# EAGLE design mk312_smt_main_V2a (EAGLE 9.6.2)

## Sheet 1 of 4: PSU
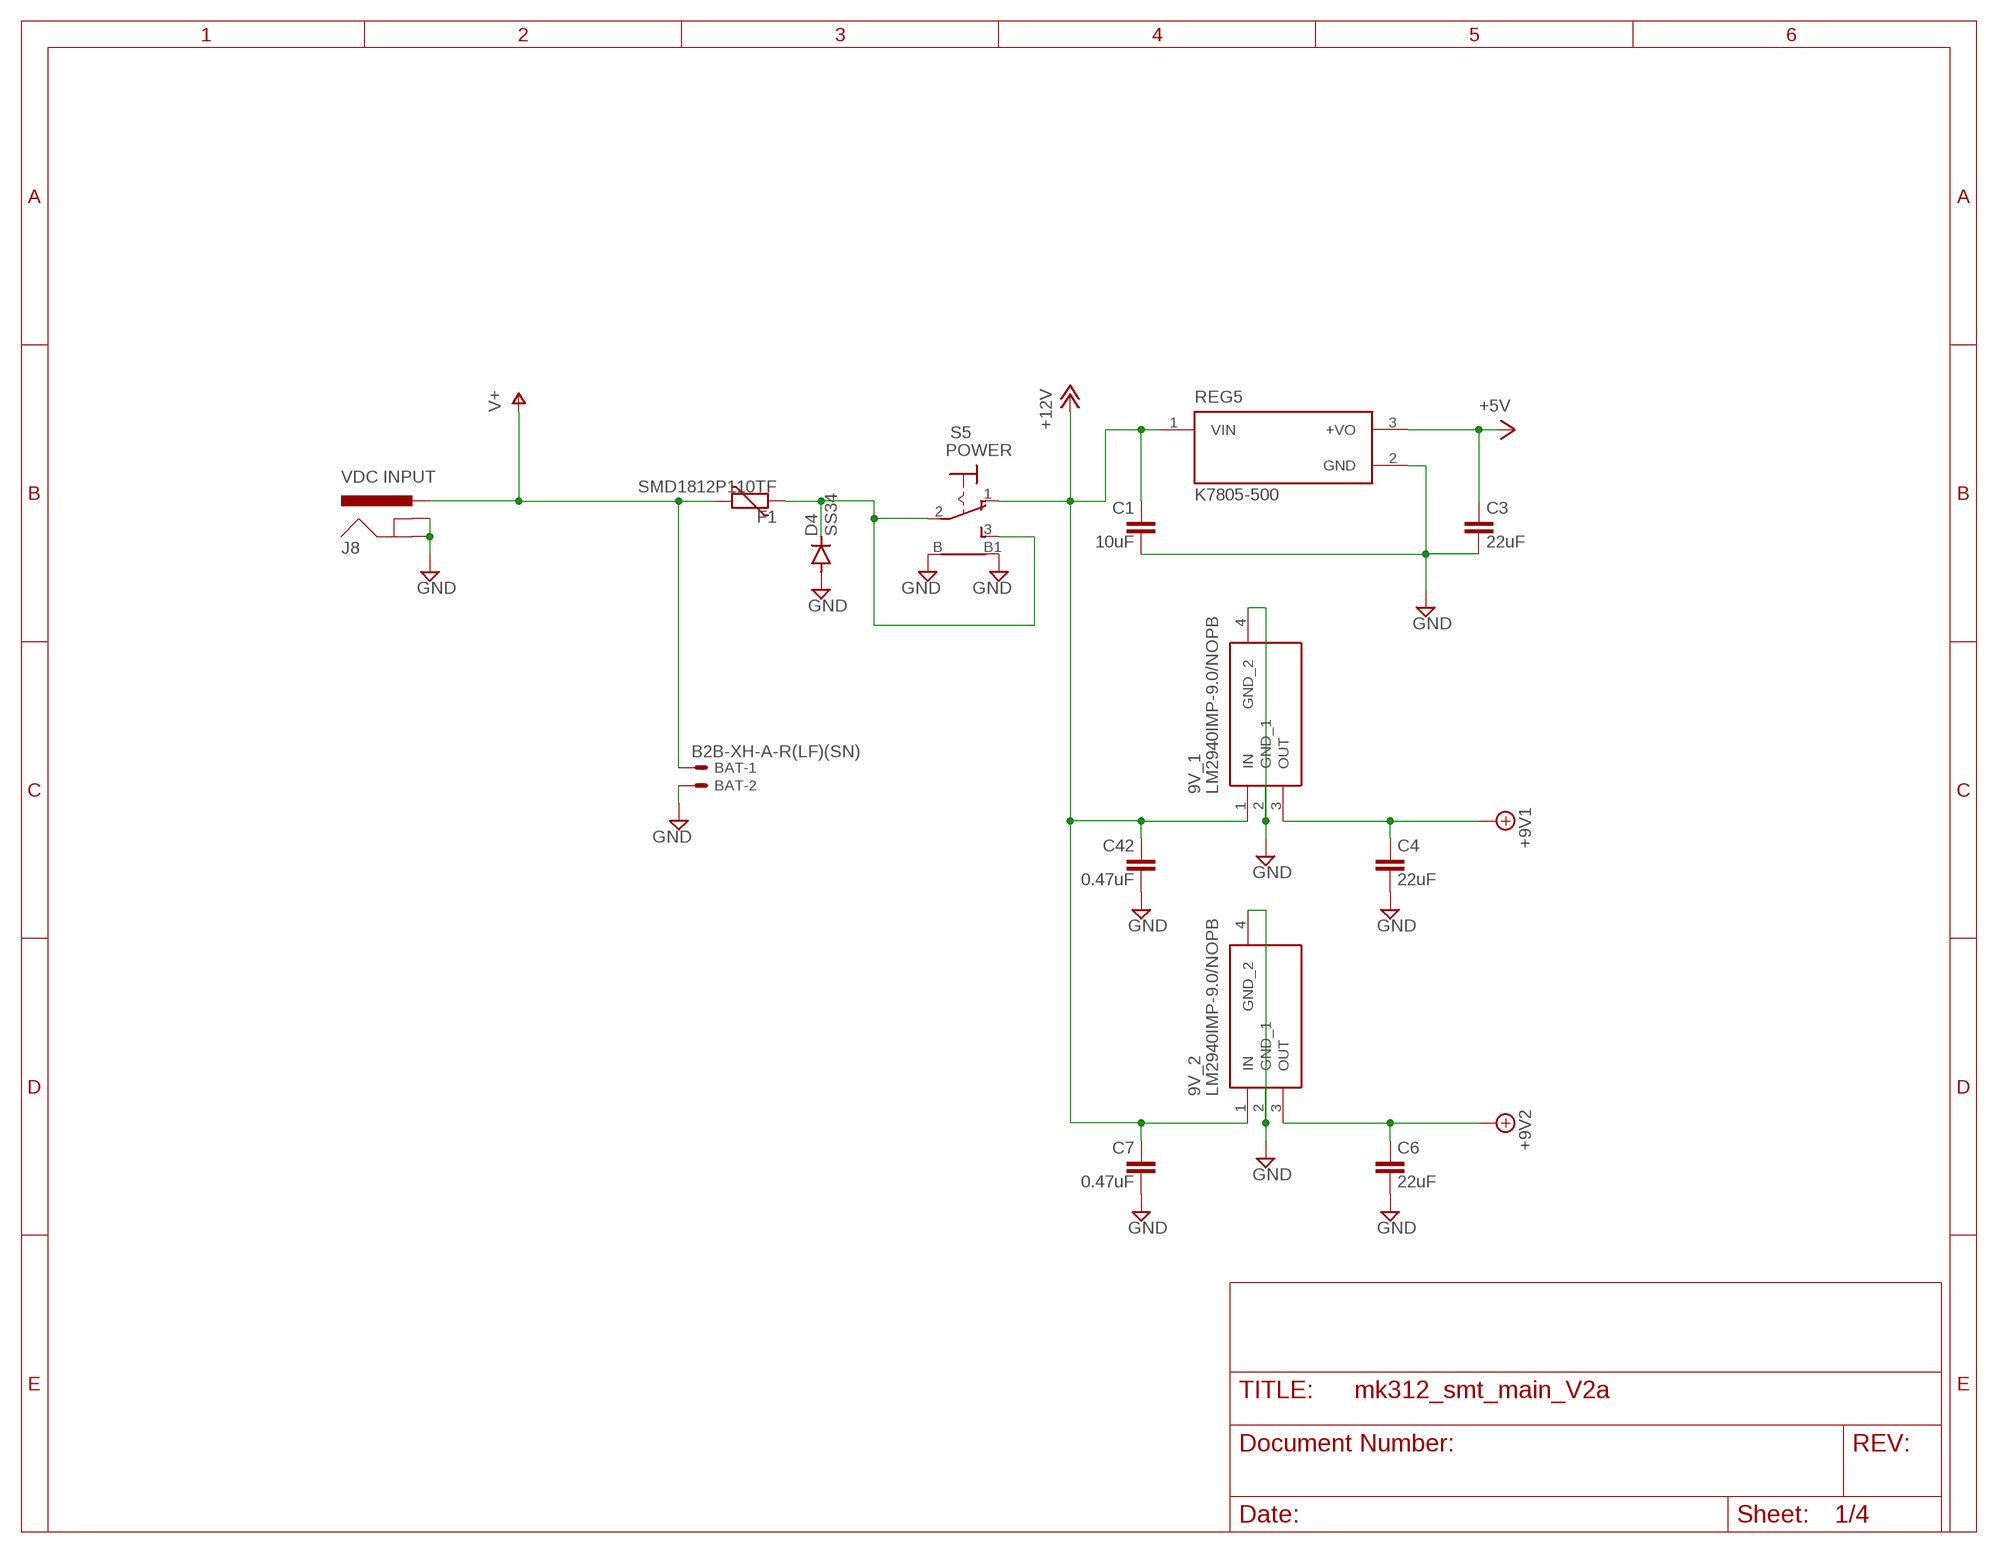
[diagram p0: schematic, sheet 1]

### Parts
9V_1  LM2940IMP-9.0/NOPB  LM2940IMP-9.0_NOPB  [SOT230P700X180-4N]
9V_2  LM2940IMP-9.0/NOPB  LM2940IMP-9.0_NOPB  [SOT230P700X180-4N]
BAT  B2B-XH-A-R(LF)(SN)  JST-XH-02-PIN-LONG-PAD  [JST-XH-02-PACKAGE-LONG-PAD]
C1  10uF  C-EUC0805  [C0805]
C3  22uF  C-EUC1206  [C1206]
C4  22uF  C-EUC1206  [C1206]
C6  22uF  C-EUC1206  [C1206]
C7  0.47uF  C-EUC0805  [C0805]
C42  0.47uF  C-EUC0805  [C0805]
D4  SS34  S1M  [SMA]
F1  SMD1812P110TF  VARISTORCN1812  [CT/CN1812]
J8  VDC INPUT  POWER_JACKPOWER_JACK_SLOT  [POWER_JACK_PTH_SLOT]
REG5  K7805-500  K7809M-1000R3  [CONV_K7809M-1000R3]
S5  POWER  LPV-1  [LPV-1]

### Nets
+5V [pwr]: C3.1 REG5.3(+VO) ; also sheet 2,3,4
+9V1 [pwr]: 9V_1.3(OUT) C4.1 ; also sheet 4
+9V2 [pwr]: 9V_2.3(OUT) C6.1 ; also sheet 4
+12V [pwr]: 9V_1.1(IN) 9V_2.1(IN) C1.1 C7.1 C42.1 REG5.1(VIN) S5.1(O) ; also sheet 2
GND [pwr]: 9V_1.2(GND_1) 9V_1.4(GND_2) 9V_2.2(GND_1) 9V_2.4(GND_2) BAT.2 C1.2 C3.2 C4.2 C6.2 C7.2 C42.2 D4.A J8.GND J8.GNDBREAK REG5.2(GND) S5.B S5.B1 ; also sheet 2,3,4
N$9 [pwr]: D4.C F1.2 S5.2(P) S5.3(S)
V+ [pwr]: BAT.1 F1.1 J8.PWR ; also sheet 2

## Sheet 2 of 4
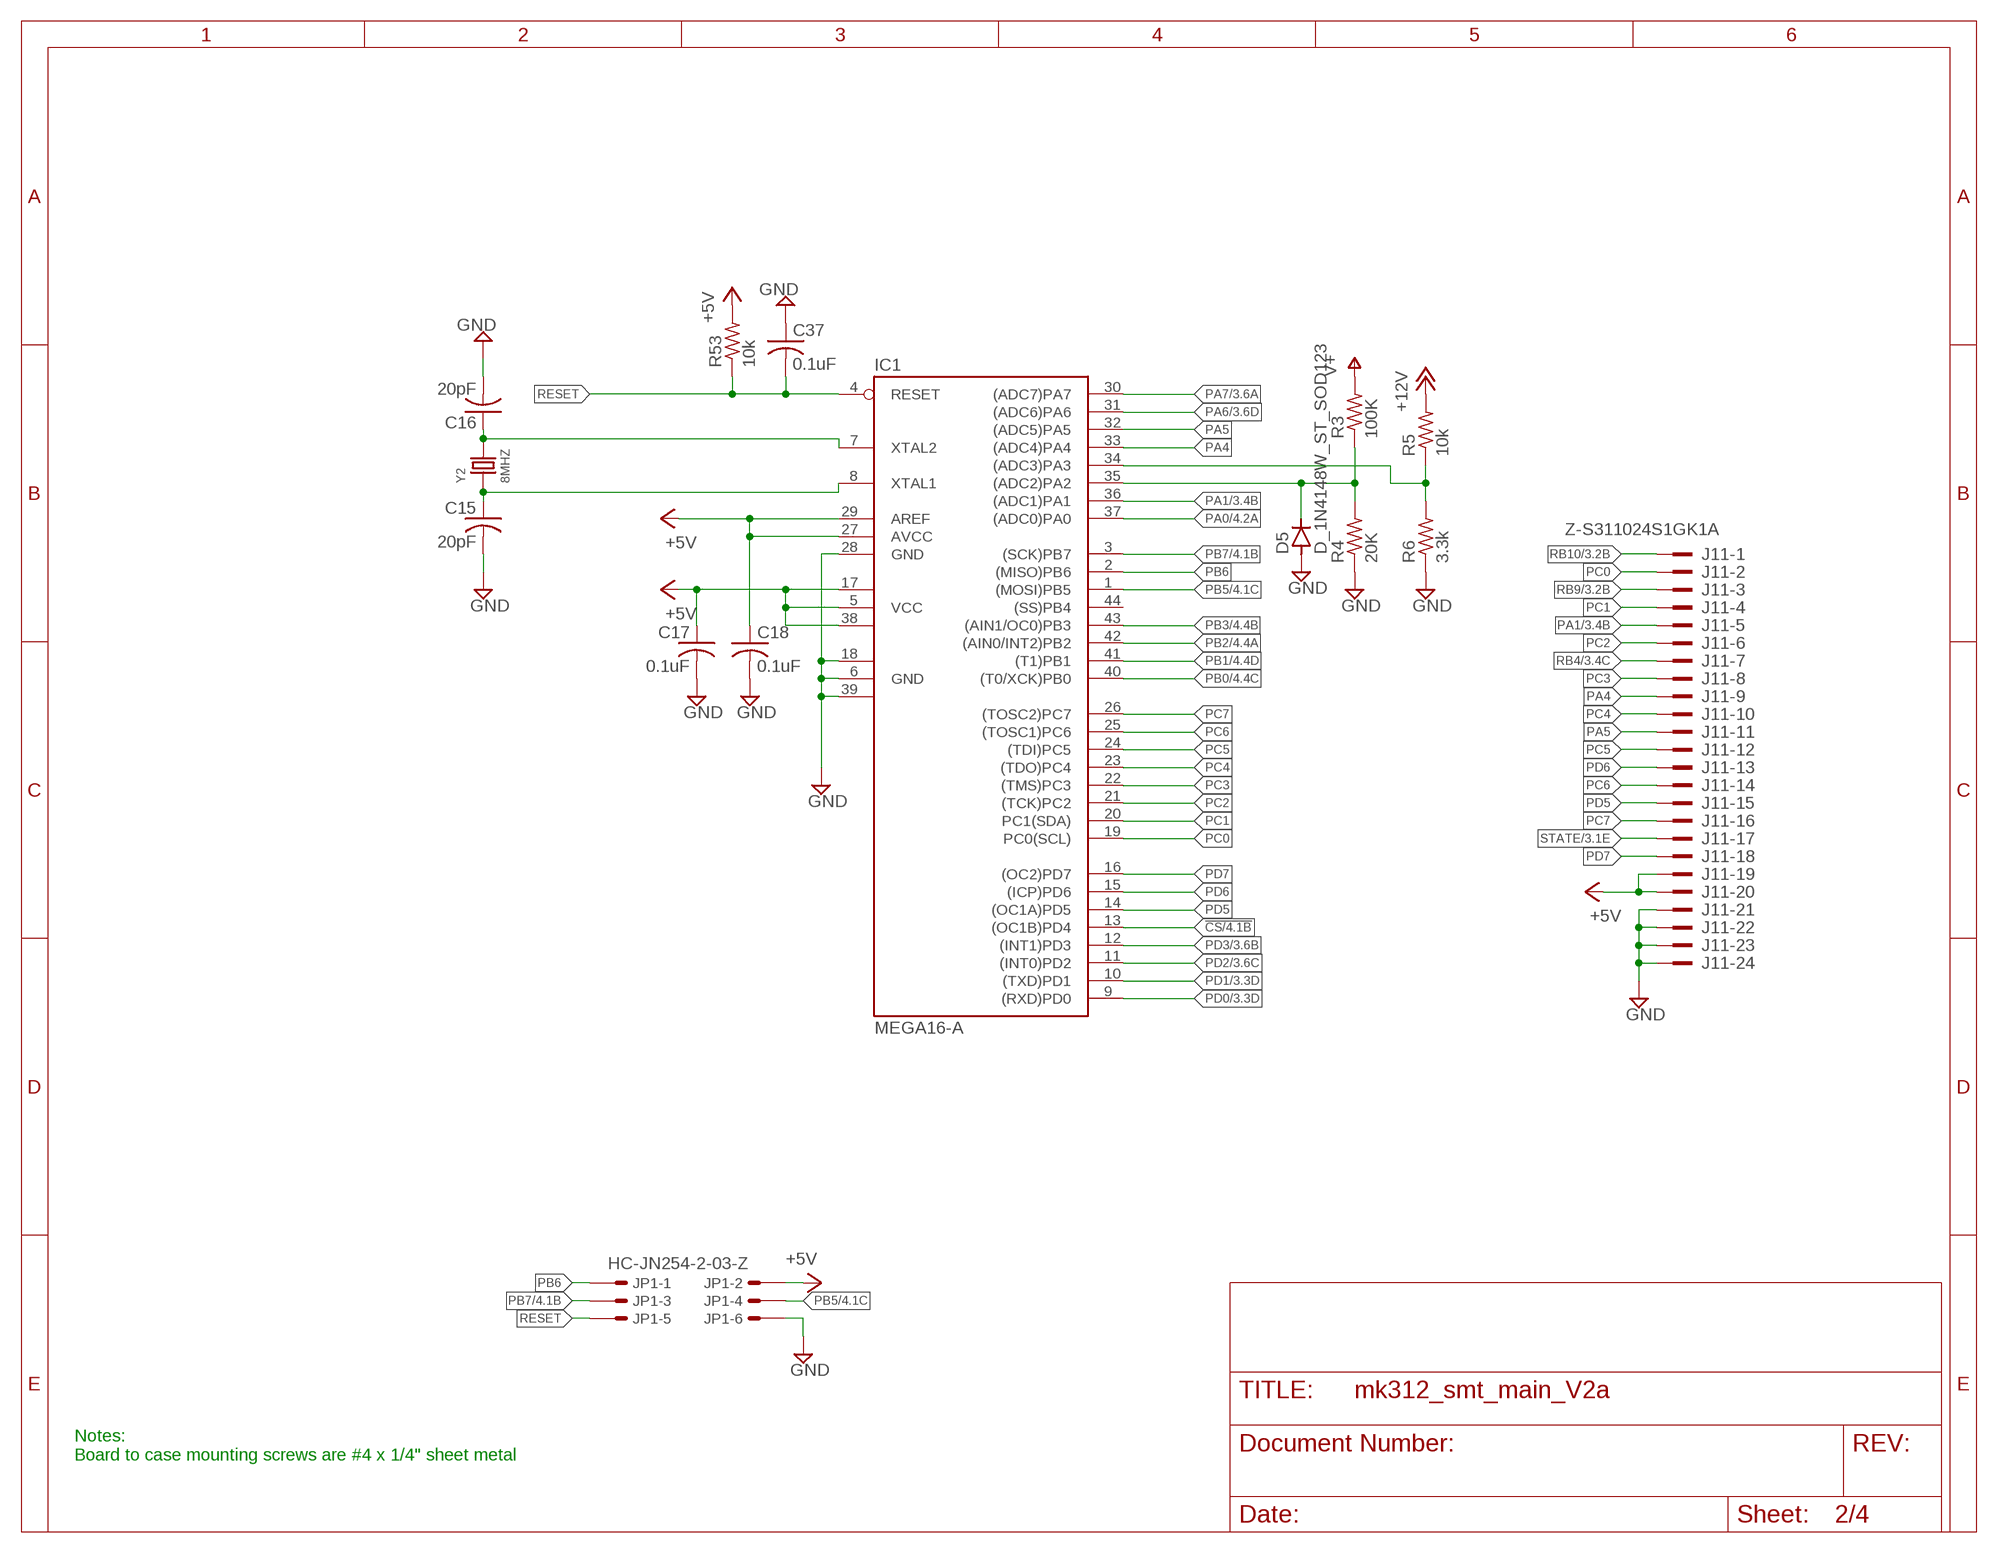
[diagram p1: schematic, sheet 2]

### Parts
C15  20pF  C-USC0603  [C0603]
C16  20pF  C-USC0603  [C0603]
C17  0.1uF  C-USC0805  [C0805]
C18  0.1uF  C-USC0805  [C0805]
C37  0.1uF  C-USC0805  [C0805]
D5  D_1N4148W_ST_SOD123  [SOD123]
IC1  MEGA16-A  [TQFP44]
J11  Z-S311024S1GK1A  2524-  [PAK100/2500-24]
JP1  HC-JN254-2-03-Z  057-006-1  [057-006-1]
R3  100K  R-US_R0805  [R0805]
R4  20K  R-US_R0805  [R0805]
R5  10k  R-US_R0805  [R0805]
R6  3.3k  R-US_R0805  [R0805]
R53  10k  R-US_R0805  [R0805]
Y2  8MHZ  SMD-CRYSTAL-8MHZ-20PF-20PPM(2P-5.0X3.2MM)  [X2-SMD-5.0X3.2X1.3MM]

### Nets
!CS: IC1.13((OC1B)PD4) ; also sheet 4
+5V [pwr]: C17.1 C18.1 IC1.5(VCC) IC1.17(VCC1) IC1.27(AVCC) IC1.29(AREF) IC1.38(VCC2) J11.19 J11.20 JP1.2 R53.2 ; also sheet 1,3,4
+12V [pwr]: R5.2 ; also sheet 1
GND [pwr]: C15.2 C16.2 C17.2 C18.2 C37.1 D5.A IC1.6(GND) IC1.18(GND1) IC1.28(GND) IC1.39(GND2) J11.21 J11.22 J11.23 J11.24 JP1.6 R4.1 R6.1 ; also sheet 1,3,4
N$1: C16.1 IC1.7(XTAL2) Y2.2
N$2: IC1.34((ADC3)PA3) R5.1 R6.2
N$3: D5.C IC1.35((ADC2)PA2) R3.1 R4.2
N$4: C15.1 IC1.8(XTAL1) Y2.1
PA0 [pwr]: IC1.37((ADC0)PA0) ; also sheet 4
PA1: IC1.36((ADC1)PA1) J11.5 ; also sheet 3
PA4: IC1.33((ADC4)PA4) J11.9
PA5: IC1.32((ADC5)PA5) J11.11
PA6: IC1.31((ADC6)PA6) ; also sheet 3
PA7: IC1.30((ADC7)PA7) ; also sheet 3
PB0: IC1.40((T0/XCK)PB0) ; also sheet 4
PB1: IC1.41((T1)PB1) ; also sheet 4
PB2: IC1.42((AIN0/INT2)PB2) ; also sheet 4
PB3: IC1.43((AIN1/OC0)PB3) ; also sheet 4
PB5: IC1.1((MOSI)PB5) JP1.4 ; also sheet 4
PB6: IC1.2((MISO)PB6) JP1.1
PB7: IC1.3((SCK)PB7) JP1.3 ; also sheet 4
PC0: IC1.19(PC0(SCL)) J11.2
PC1: IC1.20(PC1(SDA)) J11.4
PC2: IC1.21((TCK)PC2) J11.6
PC3: IC1.22((TMS)PC3) J11.8
PC4: IC1.23((TDO)PC4) J11.10
PC5: IC1.24((TDI)PC5) J11.12
PC6: IC1.25((TOSC1)PC6) J11.14
PC7: IC1.26((TOSC2)PC7) J11.16
PD0: IC1.9((RXD)PD0) ; also sheet 3
PD1: IC1.10((TXD)PD1) ; also sheet 3
PD2: IC1.11((INT0)PD2) ; also sheet 3
PD3: IC1.12((INT1)PD3) ; also sheet 3
PD5: IC1.14((OC1A)PD5) J11.15
PD6: IC1.15((ICP)PD6) J11.13
PD7: IC1.16((OC2)PD7) J11.18
RB4: J11.7 ; also sheet 3
RB9: J11.3 ; also sheet 3
RB10: J11.1 ; also sheet 3
RESET: C37.2 IC1.4(RESET) JP1.5 R53.1
STATE: J11.17 ; also sheet 3
V+ [pwr]: R3.2 ; also sheet 1
Unconnected: IC1.44((SS)PB4)

### Notes on the sheet
- Notes:
  Board to case mounting screws are #4 x 1/4" sheet metal

## Sheet 3 of 4: Input stage
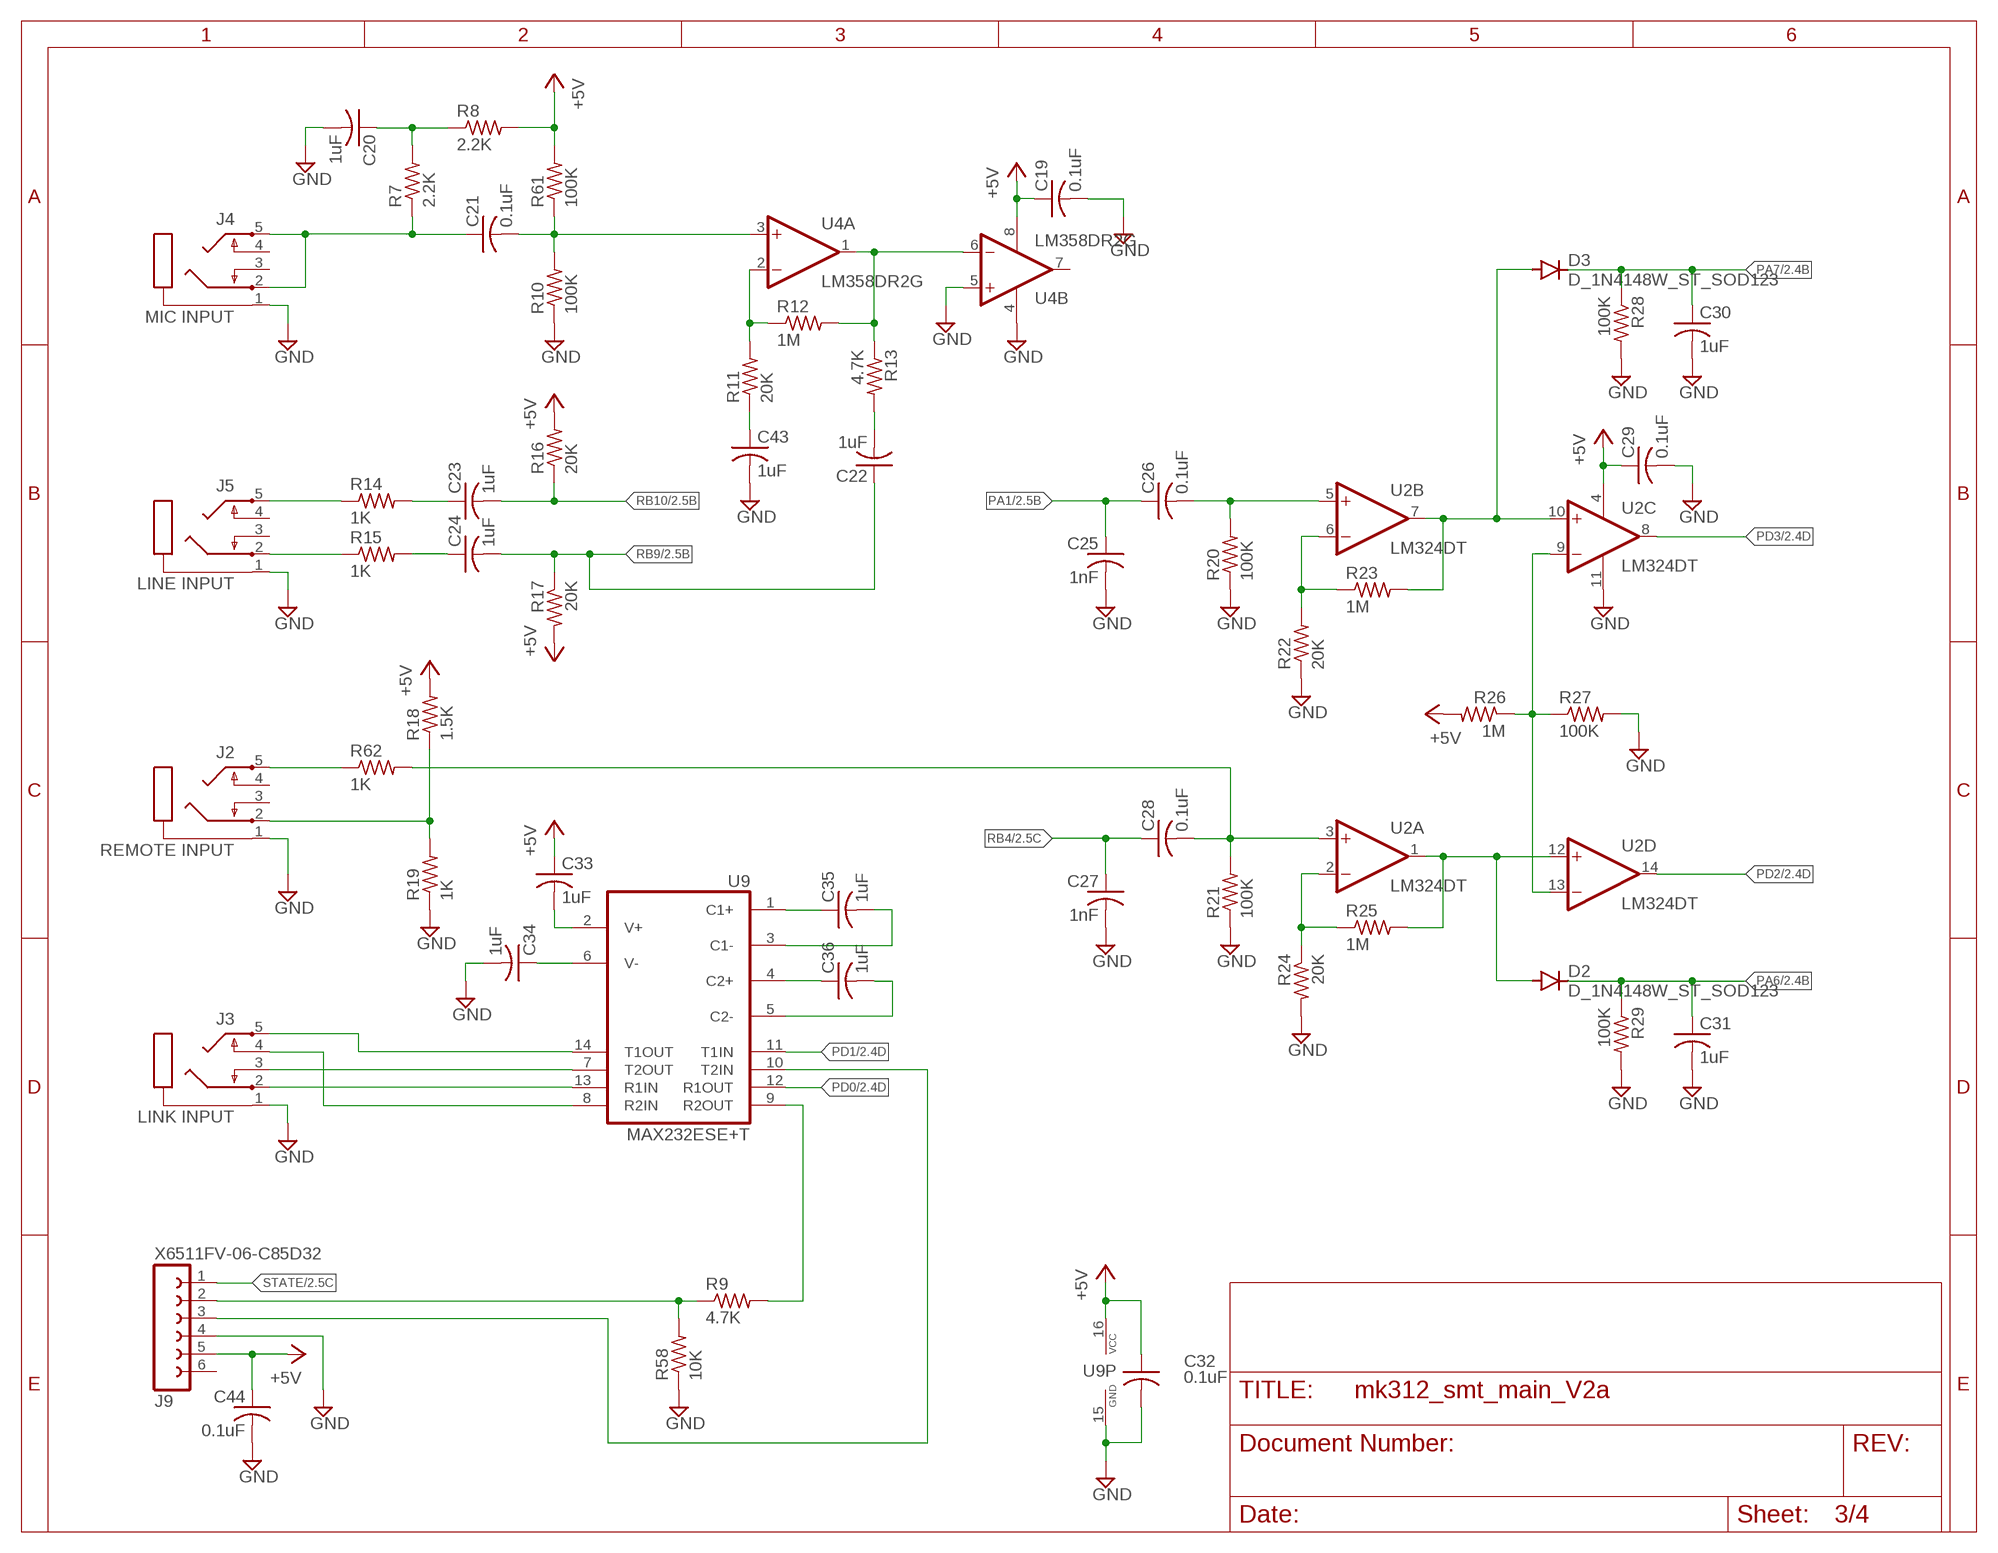
[diagram p2: schematic, sheet 3]

### Parts
C19  0.1uF  C-USC0805  [C0805]
C20  1uF  C-USC0805  [C0805]
C21  0.1uF  C-USC0805  [C0805]
C22  1uF  C-USC0805  [C0805]
C23  1uF  C-USC0805  [C0805]
C24  1uF  C-USC0805  [C0805]
C25  1nF  C-USC0805  [C0805]
C26  0.1uF  C-USC0805  [C0805]
C27  1nF  C-USC0805  [C0805]
C28  0.1uF  C-USC0805  [C0805]
C29  0.1uF  C-USC0805  [C0805]
C30  1uF  C-USC0805  [C0805]
C31  1uF  C-USC0805  [C0805]
C32  0.1uF  C-USC0805  [C0805]
C33  1uF  C-USC0805  [C0805]
C34  1uF  C-USC0805  [C0805]
C35  1uF  C-USC0805  [C0805]
C36  1uF  C-USC0805  [C0805]
C43  1uF  C-USC0805  [C0805]
C44  0.1uF  C-USC0805  [C0805]
D2  D_1N4148W_ST_SOD123  [SOD123]
D3  D_1N4148W_ST_SOD123  [SOD123]
J2  REMOTE INPUT  STEREOJACKPJ-3062  [PJ-3062]
J3  LINK INPUT  STEREOJACKPJ-3062  [PJ-3062]
J4  MIC INPUT  STEREOJACKPJ-3062  [PJ-3062]
J5  LINE INPUT  STEREOJACKPJ-3062  [PJ-3062]
J9  X6511FV-06-C85D32  FE06-1  [FE06]
R7  2.2K  R-US_R0805  [R0805]
R8  2.2K  R-US_R0805  [R0805]
R9  4.7K  R-US_R0805  [R0805]
R10  100K  R-US_R0805  [R0805]
R11  20K  R-US_R0805  [R0805]
R12  1M  R-US_R0805  [R0805]
R13  4.7K  R-US_R0805  [R0805]
R14  1K  R-US_R0805  [R0805]
R15  1K  R-US_R0805  [R0805]
R16  20K  R-US_R0805  [R0805]
R17  20K  R-US_R0805  [R0805]
R18  1.5K  R-US_R0805  [R0805]
R19  1K  R-US_R0805  [R0805]
R20  100K  R-US_R0805  [R0805]
R21  100K  R-US_R0805  [R0805]
R22  20K  R-US_R0805  [R0805]
R23  1M  R-US_R0805  [R0805]
R24  20K  R-US_R0805  [R0805]
R25  1M  R-US_R0805  [R0805]
R26  1M  R-US_R0805  [R0805]
R27  100K  R-US_R0805  [R0805]
R28  100K  R-US_R0805  [R0805]
R29  100K  R-US_R0805  [R0805]
R58  10K  R-US_R0805  [R0805]
R61  100K  R-US_R0805  [R0805]
R62  1K  R-US_R0805  [R0805]
U2  LM324DT  LM324D  [SO14]
U4  LM358DR2G  LM358D  [SO08]
U9  MAX232ESE+T  MAX232ECWESOP16  [SOP-16]

### Nets
+5V [pwr]: C19.1 C29.1 C32.1 C33.1 C44.1 J9.5 R8.2 R16.2 R17.2 R18.2 R26.2 R61.2 U2.4(P:V+) U4.8(P:V+) U9.16(VCC) ; also sheet 1,2,4
GND [pwr]: C19.2 C20.2 C25.2 C27.2 C29.2 C30.2 C31.2 C32.2 C34.2 C43.2 C44.2 J2.1 J3.1 J4.1 J5.1 J9.4 R10.1 R19.1 R20.1 R21.1 R22.1 R24.2 R27.2 R28.2 R29.2 R58.1 U2.11(P:V-) U4.4(P:V-) U4.5(B:+IN) U9.15(GND) ; also sheet 1,2,4
N$14: C28.2 R21.2 R62.2 U2.3(A:+IN)
N$33: R9.2 U9.9(R2OUT)
N$44: J3.5 U9.14(T1OUT)
N$46: J3.2 U9.13(R1IN)
N$49: C43.1 R11.1
N$50: J2.5 R62.1
N$52: C35.1 U9.1(C1+)
N$53: R24.1 R25.1 U2.2(A:-IN)
N$54: D2.A R25.2 U2.1(A:OUT) U2.12(D:+IN)
N$55: J5.2 R15.1
N$56: J5.5 R14.1
N$57: C23.1 R14.2
N$58: J2.2 R18.1 R19.2
N$60: R22.2 R23.1 U2.6(B:-IN)
N$61: C35.2 U9.3(C1-)
N$62: R26.1 R27.1 U2.9(C:-IN) U2.13(D:-IN)
N$63: C26.2 R20.2 U2.5(B:+IN)
N$65: C24.1 R15.2
N$66: C36.2 U9.5(C2-)
N$67: C36.1 U9.4(C2+)
N$68: J9.2 R9.1 R58.2
N$69: D3.A R23.2 U2.7(B:OUT) U2.10(C:+IN)
N$70 [pwr]: C34.1 U9.6(V-)
N$71: C21.1 J4.2 J4.5 R7.1
N$72: C20.1 R7.2 R8.1
N$73: C21.2 R10.2 R61.1 U4.3(A:+IN)
N$74: R11.2 R12.1 U4.2(A:-IN)
N$75: R12.2 R13.1 U4.1(A:OUT) U4.6(B:-IN)
N$76: C22.2 R13.2
N$77 [pwr]: C33.2 U9.2(V+)
N$87: J3.4 U9.8(R2IN)
N$88: J3.3 U9.7(T2OUT)
N$89: J9.3 U9.10(T2IN)
PA1: C25.1 C26.1 ; also sheet 2
PA6: C31.1 D2.C R29.1 ; also sheet 2
PA7: C30.1 D3.C R28.1 ; also sheet 2
PD0: U9.12(R1OUT) ; also sheet 2
PD1: U9.11(T1IN) ; also sheet 2
PD2: U2.14(D:OUT) ; also sheet 2
PD3: U2.8(C:OUT) ; also sheet 2
RB4: C27.1 C28.1 ; also sheet 2
RB9: C22.1 C24.2 R17.1 ; also sheet 2
RB10: C23.2 R16.1 ; also sheet 2
STATE: J9.1 ; also sheet 2
Unconnected: J2.3 J2.4 J4.3 J4.4 J5.3 J5.4 J9.6 U4.7(B:OUT)

## Sheet 4 of 4: Output stage
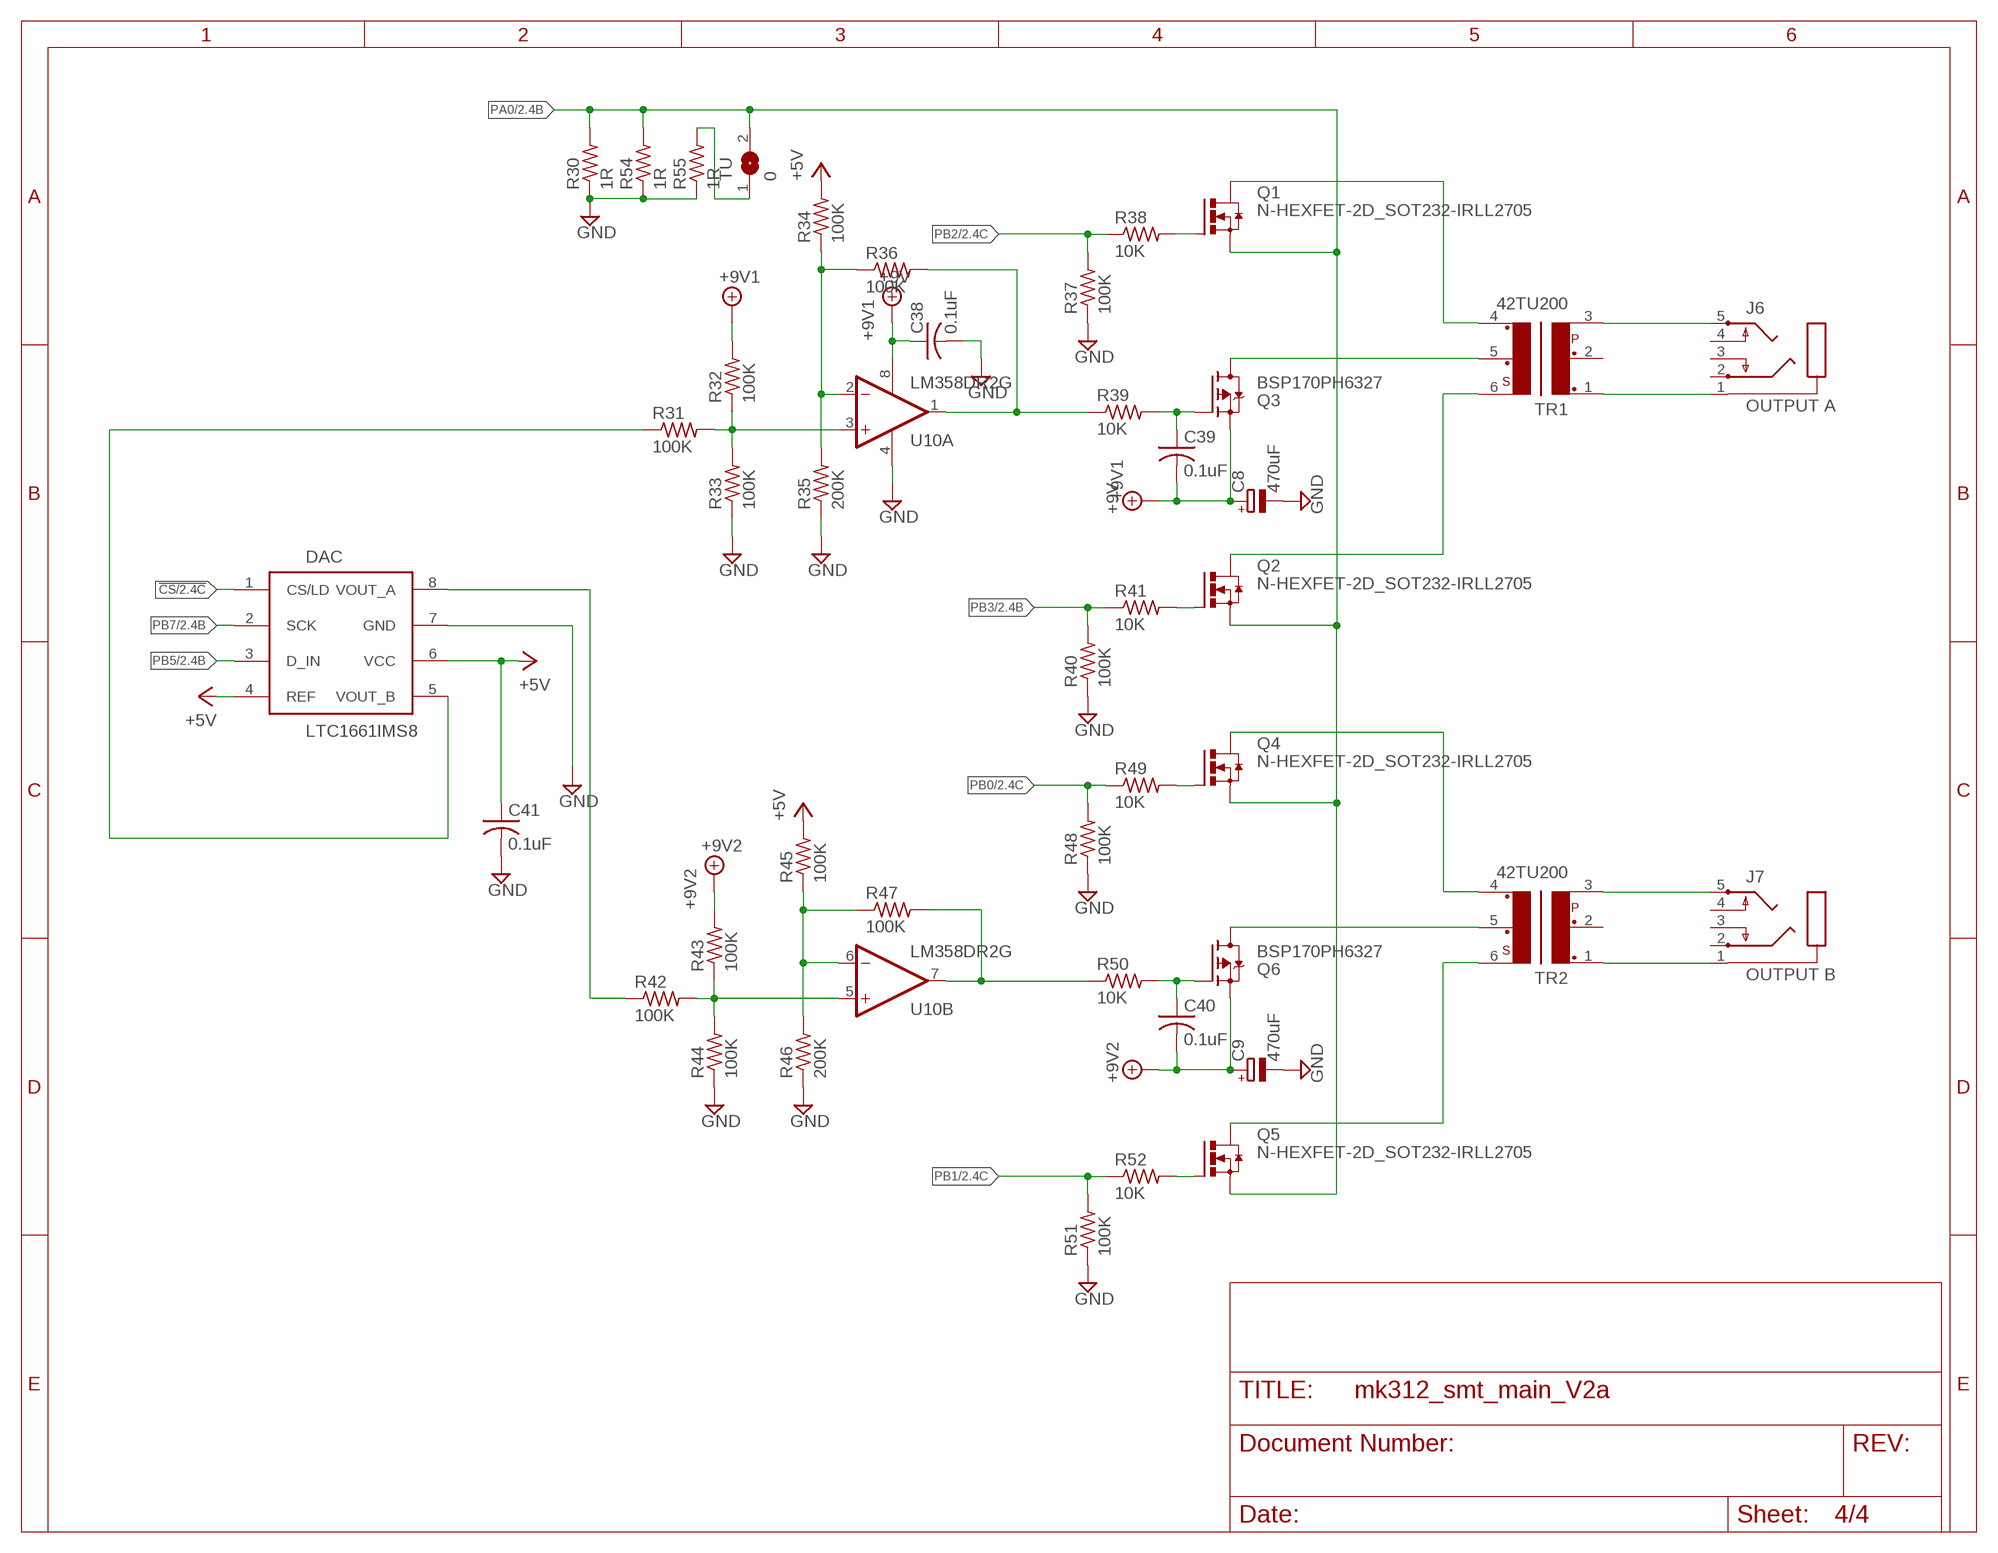
[diagram p3: schematic, sheet 4]

### Parts
C8  470uF  CPOL-EU150CLZ-1010  [150CLZ-1010]
C9  470uF  CPOL-EU150CLZ-1010  [150CLZ-1010]
C38  0.1uF  C-USC0805  [C0805]
C39  0.1uF  C-USC0805  [C0805]
C40  0.1uF  C-USC0805  [C0805]
C41  0.1uF  C-USC0805  [C0805]
DAC  LTC1661IMS8  [MSOP8]
J6  OUTPUT A  STEREOJACKPJ-3062  [PJ-3062]
J7  OUTPUT B  STEREOJACKPJ-3062  [PJ-3062]
Q1  N-HEXFET-2D_SOT232-IRLL2705  [SOT223]
Q2  N-HEXFET-2D_SOT232-IRLL2705  [SOT223]
Q3  BSP170PH6327  IRFL9014TRPBF  [SOT230P700X180-4N]
Q4  N-HEXFET-2D_SOT232-IRLL2705  [SOT223]
Q5  N-HEXFET-2D_SOT232-IRLL2705  [SOT223]
Q6  BSP170PH6327  IRFL9014TRPBF  [SOT230P700X180-4N]
R30  1R  R-US_R1206  [R1206]
R31  100K  R-US_R0805  [R0805]
R32  100K  R-US_R0805  [R0805]
R33  100K  R-US_R0805  [R0805]
R34  100K  R-US_R0805  [R0805]
R35  200K  R-US_R0805  [R0805]
R36  100K  R-US_R0805  [R0805]
R37  100K  R-US_R0805  [R0805]
R38  10K  R-US_R0805  [R0805]
R39  10K  R-US_R0805  [R0805]
R40  100K  R-US_R0805  [R0805]
R41  10K  R-US_R0805  [R0805]
R42  100K  R-US_R0805  [R0805]
R43  100K  R-US_R0805  [R0805]
R44  100K  R-US_R0805  [R0805]
R45  100K  R-US_R0805  [R0805]
R46  200K  R-US_R0805  [R0805]
R47  100K  R-US_R0805  [R0805]
R48  100K  R-US_R0805  [R0805]
R49  10K  R-US_R0805  [R0805]
R50  10K  R-US_R0805  [R0805]
R51  100K  R-US_R0805  [R0805]
R52  10K  R-US_R0805  [R0805]
R54  1R  R-US_R1206  [R1206]
R55  1R  R-US_R1206  [R1206]
TR1  42TU200  42T42TU  [42TL]
TR2  42TU200  42T42TU  [42TL]
TU  0  SJ  [SJ]
U10  LM358DR2G  LM358D  [SO08]

### Nets
!CS: DAC.1(CS/LD) ; also sheet 2
+5V [pwr]: C41.1 DAC.4(REF) DAC.6(VCC) R34.2 R45.2 ; also sheet 1,2,3
+9V1 [pwr]: C8.+ C38.1 C39.2 Q3.3(S) R32.2 U10.8(P:V+) ; supply symbol labelled +9V ; also sheet 1
+9V2 [pwr]: C9.+ C40.2 Q6.3(S) R43.2 ; also sheet 1
GND [pwr]: C8.- C9.- C38.2 C41.2 DAC.7(GND) R30.1 R33.1 R35.1 R37.1 R40.1 R44.1 R46.1 R48.1 R51.1 R54.1 R55.1 U10.4(P:V-) ; also sheet 1,2,3
N$5: R55.2 TU.1
N$6 [pwr]: Q3.2(D) Q3.4(D) TR1.5
N$8: Q6.2(D) Q6.4(D) TR2.5
N$16 [pwr]: J6.1 TR1.1
N$18: Q1.1(G) R38.2
N$19: Q2.1(G) R41.2
N$21: C39.1 Q3.1(G) R39.2
N$22: R31.2 R32.1 R33.2 U10.3(A:+IN)
N$24: Q4.1(G) R49.2
N$25: Q5.1(G) R52.2
N$26 [pwr]: J7.1 TR2.1
N$27: C40.1 Q6.1(G) R50.2
N$28: R42.2 R43.1 R44.2 U10.5(B:+IN)
N$34 [pwr]: Q1.2(D) Q1.4(D) TR1.4
N$35 [pwr]: J6.5 TR1.3
N$36 [pwr]: Q4.2(D) Q4.4(D) TR2.4
N$37 [pwr]: J7.5 TR2.3
N$38 [pwr]: Q5.2(D) Q5.4(D) TR2.6
N$39 [pwr]: Q2.2(D) Q2.4(D) TR1.6
N$40: R34.1 R35.2 R36.1 U10.2(A:-IN)
N$41: R45.1 R46.2 R47.1 U10.6(B:-IN)
N$42: DAC.5(VOUT_B) R31.1
N$85: DAC.8(VOUT_A) R42.1
PA0 [pwr]: Q1.3(S) Q2.3(S) Q4.3(S) Q5.3(S) R30.2 R54.2 TU.2 ; also sheet 2
PB0: R48.2 R49.1 ; also sheet 2
PB1: R51.2 R52.1 ; also sheet 2
PB2: R37.2 R38.1 ; also sheet 2
PB3: R40.2 R41.1 ; also sheet 2
PB5: DAC.3(D_IN) ; also sheet 2
PB7: DAC.2(SCK) ; also sheet 2
PFET_A: R36.2 R39.1 U10.1(A:OUT)
PFET_B: R47.2 R50.1 U10.7(B:OUT)
Unconnected: J6.2 J6.3 J6.4 J7.2 J7.3 J7.4 TR1.2 TR2.2

## Library data of the parts
9V_1 9V_2 = SamacSys_Parts:LM2940IMP-9.0_NOPB: LDO Voltage Regulators 1A LDO Reg Source: Datasheet <https://www.ti.com/lit/gpn/LM2940-N>; DESCRIPTION: LDO Voltage Regulators 1A LDO Reg; HEIGHT: 1.8mm; MANUFACTURER_NAME: Texas Instruments; MANUFACTURER_PART_NUMBER: LM2940IMP-9.0/NOPB; MOUSER_PART_NUMBER: 926-LM2940IMP90NOPB; MOUSER_PRICE-STOCK: https://www.mouser.co.uk/ProductDetail/Texas-Instruments/LM2940IMP-90-NOPB?qs=X1J7HmVL2ZFSe6ClMcvP2A%3D%3D
BAT = Rembrandt Electronics - JST XH Connectors v1-0:JST-XH-02-PIN: JST XH Connector 2 Pin Wire to board connector. Pitch: 2,54 mm, (0.100") Number of pins: 2 Created by Rembrandt Electronics www.rembrandtelectronics.com
C1 C3 C4 C6 C7 C42 = rcl:C-EU: CAPACITOR, European symbol; SPICEPREFIX: C
C8 C9 = rcl:CPOL-EU: POLARIZED CAPACITOR, European symbol; SPICEPREFIX: C
C15-C36 C38-C41 C43 C44 = rcl:C-US: CAPACITOR, American symbol
C37 = rcl:C-US: CAPACITOR, American symbol; SPICEPREFIX: C
D2 D3 D5 = JLC PCB Basic Parts_loc:D_: Diode; LCSC_DATASHEET: https://datasheet.lcsc.com/lcsc/1811061725_ST-Semtech-1N4148W_C81598.pdf; LCSC_PART: C81598; LCSC_ROTATION_CCW: 180; LCSC_STOCK: 1139573; PROPERTIES: 75V +150°C@(Tj) 400mW Single 1.25V@150mA 4ns 1A@75V 150mA SOD-123 Switching Diode ROHS
D4 = diode:S1M
DAC = MK312parts:LTC1661IMS8: LTC1661 DAC, MSOP-8 package
F1 = varistor:VARISTOR: VARISTOR
IC1 = atmel:MEGA16: MICROCONTROLLER 16 Kbytes FLASH 1 kbytes SRAM 512 bytes EEPROM USART 8-channel 10 bit ADC Source: avr.lbr; MPN: ATMEGA16-16AU; OC_FARNELL: 9171134; OC_NEWARK: 96K6515
J2-J7 = MK312parts:STEREOJACK: MIC/HEADPHONE JACK Stereo jack with two switches. Kycon STX3100, CUI SJ1-3555NG and/or 4UCon 05544
J8 = SparkFun-Connectors:POWER_JACK: Power Jack Connector This is the standard 5.5mm barrel jack for power. The PTH is the most common, proven, reliable, footprint. The Slot footprint only works if the mill layer is transmitted to the PCB fab house so be warned. Here are the connectors we sell at SparkFun: DC Barrel Power Jack/Connector <https://www.sparkfun.com/products/119> (PRT-00119) DC Barrel Power Jack/Connector (SMD) <https://www.sparkfun.com/products/12748> (PRT-12748) DC Barrel Jack Adapter - Breadboard Compatible <https://www.sparkfun.com/products/10811> (PRT-10811) It is used on this SparkFun product (and many, many others): SparkFun RedBoard - Programmed with Arduino <https://www.sparkfun.com/products/12757> (DEV-12757) Also, if you need a mating power supply or connector, please check these out: Wall Adapter Power Supply - 9VDC 650mA <https://www.sparkfun.com/products/298> (TOL-00298) DC Barrel Jack Adapter - Male <https://www.sparkfun.com/products/10287> (PRT-10287); PROD_ID: CONN-08197
J9 = con-lsta:FE06-1: FEMALE HEADER; OC_FARNELL: unknown; OC_NEWARK: unknown
J11 = con-3m:2524-: 3M (TM) Pak 100 4-Wall Header Source: 3M; OC_FARNELL: unknown; OC_NEWARK: unknown
JP1 = con-panduit:057-006-: CONNECTOR 6-pin series 057 contact pc board low profile headers; OC_FARNELL: unknown; OC_NEWARK: unknown
Q1 Q2 Q4 Q5 = MK312parts:N-HEXFET-2D_?-*: HEXFET® Power MOSFET 2 Drain connects http://www.irf.com/product-info/datasheets/data/irll014n.pdf
Q3 Q6 = SamacSys_Parts:IRFL9014TRPBF: IRFL9014TRPBF, P-channel MOSFET Transistor 1.8 A 60 V, 4-Pin SOT-223 Source: Datasheet <http://www.vishay.com/docs/91195/sihfl901.pdf>; ALTERNATIVE: BSP170PH6327
R3-R52 R54 R55 R58 R61 R62 = rcl:R-US_: RESISTOR, American symbol
R53 = rcl:R-US_: RESISTOR, American symbol; SPICEPREFIX: R
REG5 = SnapEDA:K7809M-1000R3: DC/DC Converter Check availability <https://pricing.snapeda.com/parts/K7809M-1000R3/Mornsun%20America%2C%20LLC/view-part?ref=eda>; AVAILABILITY: In Stock; CHECK_PRICES: https://www.snapeda.com/parts/K7809M-1000R3/MORNSUN/view-part/?ref=eda; DESCRIPTION: Non-Isolated PoL Module DC DC Converter 1 Output 9V - - - 1A 13V - 36V Input; MF: Mornsun America, LLC; MP: K7809M-1000R3; PACKAGE: SIP-3-3 MORNSUN; PRICE: None; SNAPEDA_LINK: https://www.snapeda.com/parts/K7809M-1000R3/MORNSUN/view-part/?ref=snap
S5 = MK312parts:LPV-1: TOGGLE SWITCH
TR1 TR2 = MK312parts:42T?*: Xicon Micro-Mini EI-12 Audio Transformers 42TL/42TC/42TM Series Source: http://www.mouser.com//catalog/specsheets/164201.pdf http://www.mouser.com/catalog/specsheets/114225.pdf http://www.mouser.com/catalog/specsheets/164267.pdf
TU = jumper:SJ: SMD solder JUMPER
U2 = linear:LM324: OP AMP
U4 U10 = linear:LM358: OP AMP also LM158; LM258; LM2904 Source: http://cache.national.com/ds/LM/LM158.pdf
U9 = MK312parts:MAX232ECWE: RS232 TRANSCEIVER
Y2 = Seeed-OPL-Crystal-Oscillator:SMD-CRYSTAL-8MHZ-20PF-20PPM(2P-5.0X3.2MM): 306010004; MPN: 5032/2P

## Net classes
0 default: width 0.254 mm, drill 0.254 mm, clearance 0.254 mm
1 signal: width 0.25 mm, clearance 0.076 mm
2 pwr: width 0.305 mm, drill 0.254 mm, clearance 0.203 mm

## Board
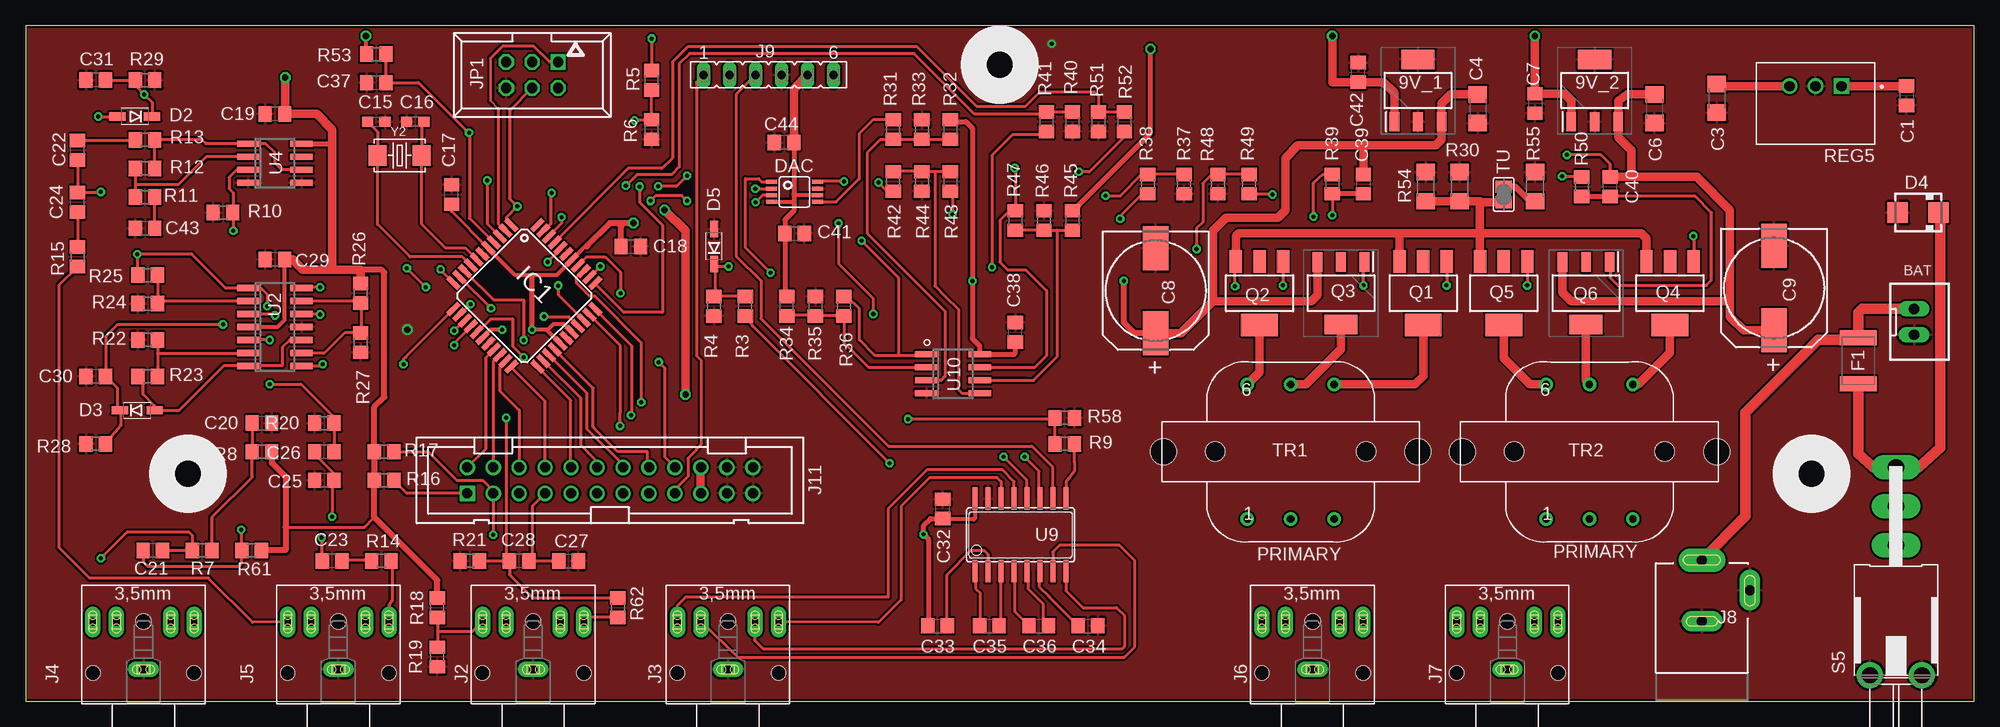
[diagram p4: board, top side]
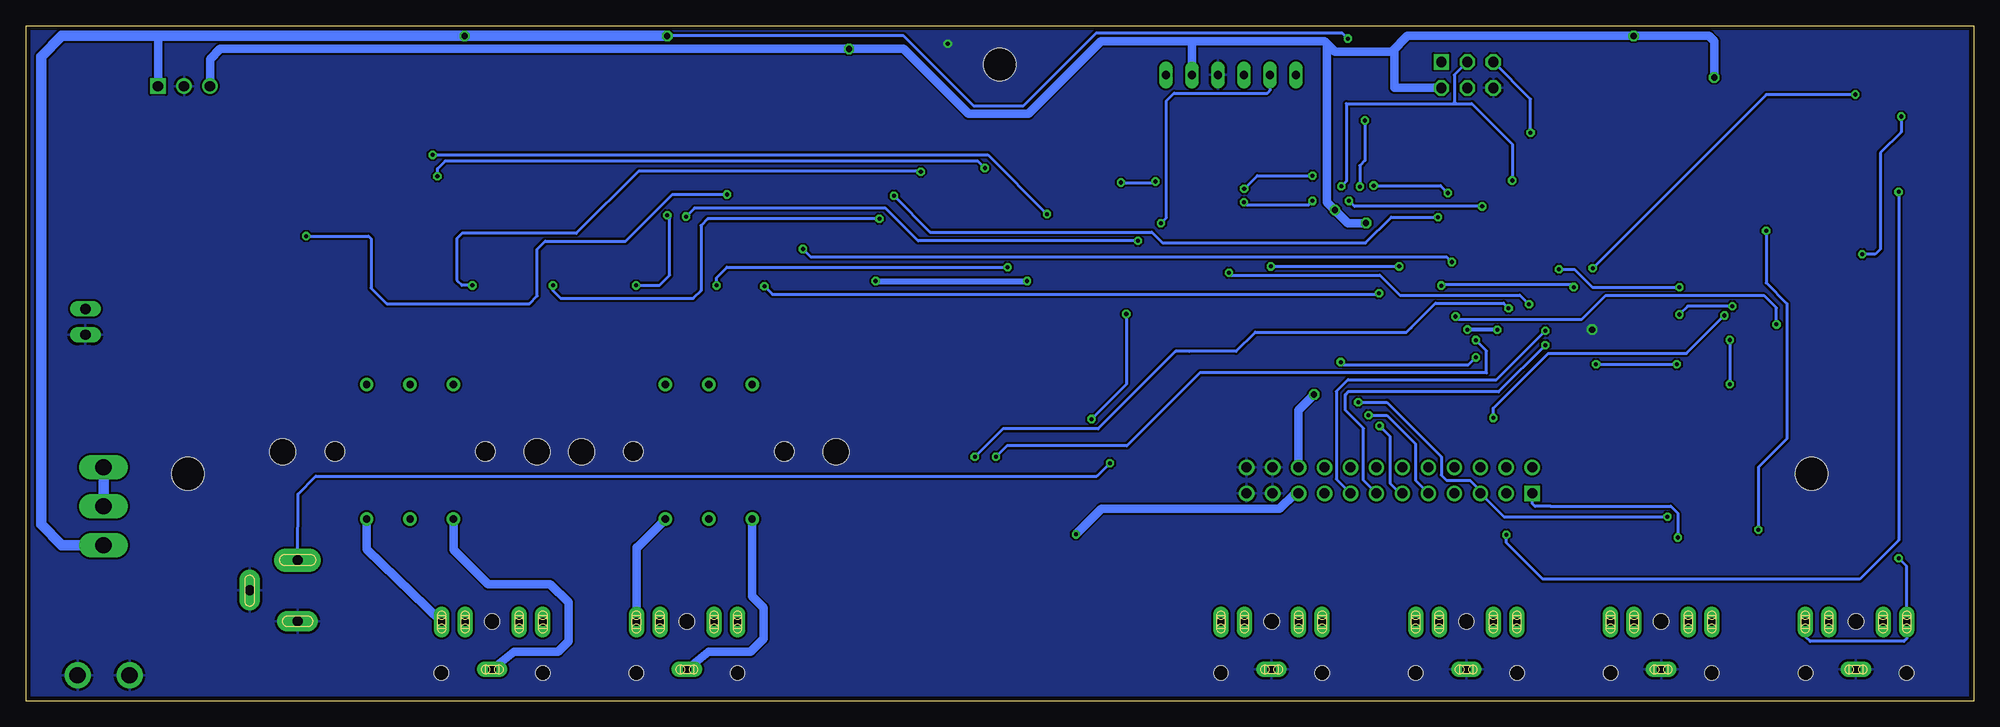
[diagram p5: board, bottom side, seen from below]

Size 190.5 x 66.04 mm. Coordinates in mm from the lower left corner, seen from the top.
Outline: 190.5,66.04 0,66.04 0,0 190.5,0 190.5,66.04
Copper layers (1*16): Top 0.035mm / dielectric 1.5mm / Bottom 0.035mm
Design rules "default *": minimum track width 10mil, minimum drill 0.4mm, track to track 8mil, track to pad 8mil, pad to pad 8mil, via to via 8mil, smd to smd 8mil, copper to edge 0mil, drill to drill 8mil, minimum pad ring 10mil, minimum via ring 8mil, stop-mask expansion 4mil, vias tented up to drill 0mil, thermal gap 10mil
Holes 3.2 mm at 15.88,22.23 174.62,22.23 95.25,62.23
Holes 1.9 mm at 116.33,24.38 131.06,24.38 145.54,24.38 160.27,24.38

### Footprints (pad centres in the part's own frame; a part is rotated, then mirrored left to right if it is on the bottom)
SOT230P700X180-4N = smd 1.9 x 0.95: 1 -3.05,2.3; 2 -3.05,0; 3 -3.05,-2.3 | smd 1.9 x 3.25: 4 3.05,0
JST-XH-02-PACKAGE-LONG-PAD = drill 1.016 long: 1 -1.27,0; 2 1.27,0
C0805 = smd 1.3 x 1.5: 1 -0.95,0; 2 0.95,0
C1206 = smd 1.6 x 1.8: 1 -1.4,0; 2 1.4,0
150CLZ-1010 = smd 4.3 x 2.5: + 4.15,0; - -4.15,0
C0603 = smd 1.1 x 1: 1 -0.85,0; 2 0.85,0
SOD123 = smd 1.6 x 0.8: A 1.7,0; C -1.7,0
SMA = smd 2 x 2: A 2,0; C -2,0
MSOP8 = smd 0.4 x 1.1: 1 -0.975,-2.25; 2 -0.325,-2.25; 3 0.325,-2.25; 4 0.975,-2.25; 5 0.975,2.25; 6 0.325,2.25; 7 -0.325,2.25; 8 -0.975,2.25
CT/CN1812 = smd 1.5 x 3.6: 1 -2.25,0; 2 2.25,0
TQFP44 = smd 1.5 x 0.5: 1 -5.8,4; 2 -5.8,3.2; 3 -5.8,2.4; 4 -5.8,1.6; 5 -5.8,0.8; 6 -5.8,0; 7 -5.8,-0.8; 8 -5.8,-1.6; 9 -5.8,-2.4; 10 -5.8,-3.2; 11 -5.8,-4; 23 5.8,-4; 24 5.8,-3.2; 25 5.8,-2.4; 26 5.8,-1.6; 27 5.8,-0.8; 28 5.8,0; 29 5.8,0.8; 30 5.8,1.6; 31 5.8,2.4; 32 5.8,3.2; 33 5.8,4 | smd 0.5 x 1.5: 12 -4,-5.8; 13 -3.2,-5.8; 14 -2.4,-5.8; 15 -1.6,-5.8; 16 -0.8,-5.8; 17 0,-5.8; 18 0.8,-5.8; 19 1.6,-5.8; 20 2.4,-5.8; 21 3.2,-5.8; 22 4,-5.8; 34 4,5.8; 35 3.2,5.8; 36 2.4,5.8; 37 1.6,5.8; 38 0.8,5.8; 39 0,5.8; 40 -0.8,5.8; 41 -1.6,5.8; 42 -2.4,5.8; 43 -3.2,5.8; 44 -4,5.8
PJ-3062 = drill 0.8 pad 1.5 long: 1 2.7,-0.1; 2 7.35,4.85; 3 7.35,2.55; 4 7.35,-2.75; 5 7.35,-5.05 | hole 1.4: 2.35,4.85; 2.35,-5.05 | hole 1.5: 7.4,-0.1
POWER_JACK_PTH_SLOT = drill 1 pad 2 long: GND 0,0; GNDBREAK -3.048,4.699 | drill 1 pad 2.3 long: PWR -5.969,0
FE06 = drill 0.813 long: 1 -6.35,0; 2 -3.81,0; 3 -1.27,0; 4 1.27,0; 5 3.81,0; 6 6.35,0
PAK100/2500-24 = drill 1 pad 1.422 square: 1 -13.97,-1.27 | drill 1 pad 1.422: 2 -13.97,1.27; 3 -11.43,-1.27; 4 -11.43,1.27; 5 -8.89,-1.27; 6 -8.89,1.27; 7 -6.35,-1.27; 8 -6.35,1.27; 9 -3.81,-1.27; 10 -3.81,1.27; 11 -1.27,-1.27; 12 -1.27,1.27; 13 1.27,-1.27; 14 1.27,1.27; 15 3.81,-1.27; 16 3.81,1.27; 17 6.35,-1.27; 18 6.35,1.27; 19 8.89,-1.27; 20 8.89,1.27; 21 11.43,-1.27; 22 11.43,1.27; 23 13.97,-1.27; 24 13.97,1.27
057-006-1 = drill 1 square: 1 -2.54,-1.27 | drill 1 octagon: 2 -2.54,1.27; 3 0,-1.27; 4 0,1.27; 5 2.54,-1.27; 6 2.54,1.27
SOT223 = smd 1.219 x 2.235: 1 -2.311,-3.099; 2 0,-3.099; 3 2.311,-3.099 | smd 3.6 x 2.2: 4 0,3.099
R0805 = smd 1.3 x 1.5: 1 -0.95,0; 2 0.95,0
R1206 = smd 1.6 x 1.803: 1 -1.422,0; 2 1.422,0
CONV_K7809M-1000R3 = drill 1 square: 1 -2.54,-1.7 | drill 1: 2 0,-1.7; 3 2.54,-1.7
LPV-1 = drill 1.6 long: 1 0,12.7; 2 0,16.51; 3 0,20.32 | drill 1.6 pad 2.54: B -2.54,0; B1 2.54,0
42TL = drill 0.7 pad 1.3: 1 -4.242,-6.579; 2 0,-6.579; 3 4.242,-6.579; 4 4.242,6.579; 5 0,6.579; 6 -4.242,6.579 | hole 2.54: -12.446,0; 12.446,0
SJ = smd 1.168 x 1.6: 1 -0.762,0; 2 0.762,0
SO14 = smd 0.6 x 2.2: 1 -3.81,-2.6; 2 -2.54,-2.6; 3 -1.27,-2.6; 4 0,-2.6; 5 1.27,-2.6; 6 2.54,-2.6; 7 3.81,-2.6; 8 3.81,2.6; 9 2.54,2.6; 10 1.27,2.6; 11 0,2.6; 12 -1.27,2.6; 13 -2.54,2.6; 14 -3.81,2.6
SO08 = smd 0.6 x 2.2: 1 -1.905,-2.6; 2 -0.635,-2.6; 3 0.635,-2.6; 4 1.905,-2.6; 5 1.905,2.6; 6 0.635,2.6; 7 -0.635,2.6; 8 -1.905,2.6
SOP-16 = smd 0.5 x 2.2: 1 -4.445,-3.55; 2 -3.185,-3.55; 3 -1.915,-3.55; 4 -0.645,-3.55; 5 0.635,-3.55; 6 1.895,-3.55; 7 3.165,-3.55; 8 4.435,-3.55; 9 4.445,3.55; 10 3.175,3.55; 11 1.905,3.55; 12 0.635,3.55; 13 -0.635,3.55; 14 -1.905,3.55; 15 -3.175,3.55; 16 -4.445,3.55
X2-SMD-5.0X3.2X1.3MM = smd 1.778 x 2.032: 1 -2.159,0; 2 2.159,0

### Placement (x,y rotation side)
9V_1  136.14,59.69 90 top
9V_2  153.42,59.69 90 top
BAT  184.66,37.08 270 top
C1  183.9,59.18 270 top
C3  165.35,58.93 270 top
C4  141.99,57.91 270 top
C6  159.26,57.91 270 top
C7  147.57,58.42 270 top
C8  110.49,40.13 270 top
C9  170.94,40.39 270 top
C15  34.29,56.64 0 top
C16  38.1,56.64 180 top
C17  41.66,49.53 90 top
C18  59.18,44.45 0 top
C19  24.38,57.4 180 top
C20  23.11,27.18 0 top
C21  12.45,14.73 180 top
C22  5.08,53.85 90 top
C23  29.97,13.72 180 top
C24  5.08,48.77 90 top
C25  29.21,21.59 180 top
C26  29.21,24.38 0 top
C27  53.09,13.72 0 top
C28  48.26,13.72 180 top
C29  24.38,43.18 180 top
C30  6.86,31.75 180 top
C31  6.86,60.71 180 top
C32  89.66,18.8 90 top
C33  89.15,7.37 0 top
C34  103.89,7.37 0 top
C35  94.23,7.37 0 top
C36  99.06,7.37 0 top
C37  34.29,60.45 0 top
C38  96.77,36.07 90 top
C39  130.81,50.55 90 top
C40  154.94,50.29 90 top
C41  75.18,45.72 0 top
C42  130.3,61.47 90 top
C43  11.68,46.23 180 top
C44  74.17,54.61 180 top
D2  10.67,57.15 180 top
D3  10.92,28.45 0 top
D4  185.04,47.75 180 top
D5  67.31,44.45 90 top
DAC  75.18,49.78 270 top
F1  179.2,33.27 270 top
IC1  48.77,39.62 315 top
J2  49.53,0.4 90 top
J3  68.58,0.4 90 top
J4  11.43,0.4 90 top
J5  30.48,0.4 90 top
J6  125.73,0.4 90 top
J7  144.78,0.4 90 top
J8  163.9,7.8 270 top
J9  72.64,61.21 0 top
J11  57.15,21.59 0 top
JP1  49.53,61.21 180 top
Q1  136.65,39.88 180 top
Q2  120.65,39.88 180 top
Q3  128.61,39.88 270 top
Q4  160.78,39.88 180 top
Q5  144.53,39.88 180 top
Q6  152.57,39.88 270 top
R3  70.36,38.61 270 top
R4  67.31,38.61 90 top
R5  61.21,60.71 90 top
R6  61.21,55.88 90 top
R7  17.27,14.73 0 top
R8  23.11,24.38 0 top
R9  101.6,25.15 0 top
R10  19.3,47.75 0 top
R11  11.68,49.28 180 top
R12  11.68,52.07 0 top
R13  11.68,54.86 180 top
R14  34.8,13.72 180 top
R15  5.08,43.43 90 top
R16  35.05,21.59 180 top
R17  35.05,24.38 180 top
R18  40.26,9.14 90 top
R19  40.26,4.32 90 top
R20  29.21,27.18 0 top
R21  43.43,13.72 0 top
R22  11.94,35.31 0 top
R23  11.94,31.75 180 top
R24  11.94,38.86 180 top
R25  11.94,41.66 180 top
R26  32.77,39.88 90 top
R27  32.77,35.05 270 top
R28  6.86,25.15 180 top
R29  11.68,60.71 0 top
R30  140.21,50.29 270 top
R31  84.84,55.88 270 top
R32  90.42,55.88 90 top
R33  87.63,55.88 270 top
R34  74.42,38.61 90 top
R35  77.22,38.61 270 top
R36  80.01,38.61 90 top
R37  113.28,50.55 90 top
R38  109.73,50.55 270 top
R39  127.76,50.55 270 top
R40  102.36,56.64 90 top
R41  99.82,56.64 270 top
R42  84.84,50.8 90 top
R43  90.42,50.8 270 top
R44  87.63,50.8 90 top
R45  102.36,46.99 90 top
R46  99.57,46.99 270 top
R47  96.77,46.99 90 top
R48  116.59,50.55 90 top
R49  119.63,50.55 270 top
R50  152.15,50.29 270 top
R51  104.9,56.64 90 top
R52  107.44,56.64 270 top
R53  34.29,63.25 180 top
R54  136.91,50.29 270 top
R55  147.57,50.29 270 top
R58  101.6,27.69 180 top
R61  22.1,14.73 0 top
R62  57.91,9.14 90 top
REG5  175.01,58.42 180 top
S5  182.88,2.54 0 top
TR1  123.7,24.38 0 top
TR2  152.91,24.38 0 top
TU  144.53,49.53 270 top
U2  24.38,36.58 270 top
U4  24.38,52.58 270 top
U9  97.28,16.26 0 top
U10  90.68,32 270 top
Y2  36.58,53.34 0 top

### Tracks (layer width: path | path; a pad name or v marks a point on that pad's centre or on a via)
!CS  (via drill 0.4)
  Top 0.3: v72.83,41.88 70.36,44.35 70.36,51.08 71.69,51.08 71.96,50.76 DAC.1 | v43.5,38.8 42.5,37.8 IC1.13
  Bottom 0.3: v43.5,38.8 44.4,39.7 56.13,39.7 58.09,41.66 72.61,41.66 v72.83,41.88
+5V  (via drill 0.4, 0.6)
  Top 0.305: 66,20.4 J11.19 | 66,22.8 J11.20 | 44.7,35.6 IC1.17 | 23.06,14.78 R61.2 | R45.2 102.4,47.94 | C17.1 41.66,47.87 IC1.5 | 25.41,17.02 33.15,17.02 34.1,17.97
  Top 0.406: 74.23,39.75 R34.2 | v33.27,65.02 33.27,63.18 R53.2 | U2.4 24.64,36.58 25.33,37.27 C29.1 | IC1.27 51,36.26 | 51,36.26 50.94,36.32 v49.53,36.32 | IC1.29 52.69,36.83 51.56,36.83 51,36.26 | 54.86,44.45 54.73,44.45 IC1.38 51.93,41.66 49.53,41.66 47.87,41.66 IC1.5 | v46.6,36.3 45.44,36.3 44.74,35.6 44.7,35.6 | DAC.4 75.08,48.81 75.12,48.77 | DAC.6 75.19,49.46 75.12,49.53 | U9.16 92.84,17.91 92.71,17.78 89.73,17.78 C32.1
  Top 0.508: 74.23,39.75 C41.1 74.23,47.06 75.12,47.94 75.12,48.77 75.12,49.53 C44.1 | C33.1 88.28,7.44 88.28,15.82 v87.8,16.3 87.8,17.19 88.46,17.85 C32.1 | U4.8 29.84,54.48 29.97,54.36 | v49.53,36.32 49.53,41.66 | 102.4,47.94 109.98,55.52 v109.98,63.75
  Top 0.61: C19.1 25.4,57.47 | C29.1 26.1,43.18 | 23.06,14.78 25.41,14.78 25.41,17.02 25.41,21.95 24.06,23.3 R8.2 | 54.86,44.45 57.15,46.74 57.91,46.74 | v59.44,46.74 57.91,46.74 | C18.1 58.23,46.42 57.91,46.74 | R18.2 40.26,11.81 34.1,17.97 R16.2 R17.2 34.1,28.76 35.06,29.72 35.06,41.9 34.8,42.16 32,42.16
  Top 0.813: C44.1 75.12,59.88 J9.5 | v25.4,60.96 25.4,57.47 | 29.97,42.16 27.11,42.16 26.1,43.18 | 29.97,42.16 32,42.16 32.77,42.16 R26.2 | 66,22.8 66,20.4 | C19.1 28.45,57.4 29.97,55.88 29.97,54.36 29.97,42.16 | v62.48,48.01 64.52,45.97 v64.52,29.97 | REG5.3 165.56,60.12 C3.1
  Bottom 0.305: 66.1,20.3 J11.19
  Bottom 0.406: v46.6,36.3 46.62,36.32 v49.53,36.32
  Bottom 0.61: 66.1,20.3 66.4,20.3
  Bottom 0.813: 76.45,64.52 J9.5 | 76.45,64.52 85.34,64.52 92.46,57.4 98.3,57.4 104.65,63.75 v109.98,63.75 171.45,63.75 172.47,62.74 REG5.3 | 76.45,64.52 63.5,64.52 63.25,64.26 | 63.25,64.26 63.25,48.77 v62.48,48.01 61.21,46.74 v59.44,46.74 | 63.25,64.26 62.48,63.5 56.9,63.5 | 56.9,63.5 55.37,65.02 v33.27,65.02 25.91,65.02 25.4,64.52 v25.4,60.96 | 56.9,63.5 56.64,63.5 56.64,59.94 JP1.2 | v87.8,16.3 85.3,18.8 67.9,18.8 66.4,20.3 | v64.52,29.97 66.04,28.45 J11.20
+9V1  (via drill 0.4)
  Top 0.305: 96.65,33.91 96.77,34.04
  Top 0.508: 96.65,33.91 U10.8 93.28,34.74 92.58,35.44 v92.58,41.07 92.58,56.01 91.95,56.64 90.61,56.64 R32.2 | 96.77,34.04 C38.1
  Top 0.61: C8.+ 108.4,35.98 107.38,37.01 v107.38,41.07
  Top 0.813: C4.1 139.34,59.31 138.44,58.42 9V_1.3 138.44,54.88 137.89,54.32 130.81,54.32 | Q3.3 126.31,39.7 125.73,39.12 116.08,39.12 | C8.+ 112.94,35.98 116.08,39.12 | 116.08,39.12 116.08,45.97 117.35,47.24 122.43,47.24 123.19,48.01 123.19,53.09 124.43,54.32 130.81,54.32 | 130.81,54.32 C39.2
  Bottom 0.61: v107.38,41.07 v92.58,41.07
+9V2  (via drill 0.4)
  Top 0.305: R43.2 90.63,49.64 v90.63,47.61 | v150.7,53.4 154,53.4 154.94,52.46 C40.2
  Top 0.508: 156.92,51.24 156.99,51.31
  Top 0.813: C6.1 156.63,59.31 155.72,58.69 9V_2.3 155.72,55.12 156.99,53.85 156.99,51.31 | Q6.3 150.27,39.98 151.13,39.12 166.62,39.12 | C9.+ 167.98,36.24 166.62,37.59 166.62,39.12 | C40.2 156.92,51.24 163.39,51.24 166.62,48.01 166.62,39.12
  Bottom 0.305: v90.63,47.61 96.42,53.4 v150.7,53.4
+12V  (via drill 0.4, 0.6)
  Top 0.305: v61.21,64.77 R5.2
  Top 0.813: v127.76,65.02 127.76,60.52 C42.1 132.78,60.52 133.84,59.45 9V_1.1 | v147.57,65.02 C7.1 150.43,59.37 151.12,58.69 9V_2.1 | C1.1 177.56,60.13 REG5.1
  Bottom 0.305: v61.21,64.77 61.72,65.28 85.85,65.28 92.96,58.17 97.79,58.17 104.65,65.02 v127.76,65.02
  Bottom 0.813: 177.55,65.02 REG5.1
  Bottom 1.016: S5.1 186.94,15.24 188.98,17.27 188.98,62.99 186.94,65.02 177.55,65.02 v147.57,65.02 v127.76,65.02
GND  (via drill 0.4, 0.6)
  other vias: 37.34,36.32 100.33,64.26
  pour Top: 0.25,65.79 190.25,65.79 190.25,0.25 0.25,0.25
  pour Bottom: 0.51,65.53 189.99,65.53 189.99,0.51 0.51,0.51
N$1
  Top 0.3: IC1.7 44.1,43.2 43,44.3 41.04,44.3 38.73,46.61 Y2.2 | C16.1 38.73,56.43
  Top 0.305: 38.73,56.43 Y2.2
N$2  (via drill 0.4)
  Top 0.3: v59.55,56.76 59.58,56.8 61.2,56.8 R6.2 61.2,56.9 61.2,59.7 R5.1 | 55.7,40.8 IC1.34
  Top 0.305: 55.7,40.8 58.49,38.01 62.26,38.01 62.26,46.54 60.05,48.75 v60.05,50.3
  Bottom 0.305: v60.05,50.3 60.05,52.35 59.55,52.85 v59.55,56.76
N$3  (via drill 0.4)
  Top 0.3: R3.1 70.3,39.6 67.4,39.6 R4.2 67.4,39.7 67.4,42.5 D5.C 67.3,42.7 67.3,42.5 v68.74,42.5 | v56.2,42.5 55.2,41.5 IC1.35
  Bottom 0.3: v68.74,42.5 v56.2,42.5
N$4
  Top 0.3: IC1.8 42.7,43.43 37.59,43.43 34.42,46.61 Y2.1
  Top 0.305: C15.1 34.42,55.66 Y2.1
N$5
  Top 0.61: R55.2 147.07,48.87 145.64,50.29 TU.1
N$6
  Top 0.813: TR1.5 125.2,30.96 128.61,34.38 Q3.4
N$8
  Top 0.813: Q6.4 152.57,31.3 TR2.5
N$9
  Top 0.813: 187.2,47.59 D4.C
  Top 1.016: 187.2,47.59 187.2,24.78 185.09,22.86 S5.3 180.66,22.86 179.2,24.19 F1.2
  Bottom 1.016: S5.3 S5.2
N$14  (via drill 0.4)
  Top 0.3: v24.4,37.7 24.4,37.8 21.8,37.8 U2.3 | v46.99,27.69 46.99,14.04 C28.2
  Top 0.305: R21.2 C28.2 47.31,12.38 49.6,10.09 R62.2
  Bottom 0.3: 28.1,34 v24.4,37.7
  Bottom 0.305: 28.1,34 41.63,34 46.99,28.64 v46.99,27.69
N$16
  Bottom 0.813: TR1.1 119.46,10.24 118.36,9.14 118.36,6.1 119.63,4.83 123.7,4.83 J6.1
N$18  (via drill 0.4)
  Top 0.3: R38.2 109.22,49.6 107.02,47.4 v107.02,47.15
  Top 0.305: Q1.1 138.96,40.66 v138.94,40.64
  Bottom 0.305: v107.02,47.15 123.8,47.15 124.46,46.48 124.46,40.13 125.22,39.37 138.18,39.37 138.94,40.13 v138.94,40.64
N$19  (via drill 0.4)
  Top 0.305: Q2.1 122.96,40.66 v122.94,40.64 | R41.2 99.5,55.37 96.52,55.37 94.49,53.34 v94.49,42.42
  Bottom 0.305: v122.94,40.64 122.94,41.4 121.92,42.42 v94.49,42.42
N$21  (via drill 0.4)
  Top 0.305: v130.81,40.64 130.81,43.09 Q3.1 | R39.2 v127.76,47.5
  Top 0.508: C39.1 R39.2
  Bottom 0.305: v130.81,40.64 128.52,40.64 127.51,41.66 127.51,47.24 v127.76,47.5
N$22
  Top 0.3: R31.2 84.9,54.87 87.57,54.87 R33.2 87.69,54.87
  Top 0.305: R31.2 84.77,54.86 83.57,54.86 82.3,53.59 82.3,45.72 89.92,38.1 89.92,31.75 89.53,31.37 U10.3 | R32.1 90.36,54.87 87.69,54.87
N$24  (via drill 0.4)
  Top 0.305: v163.07,45.47 163.09,45.44 Q4.1 | v121.92,49.53 119.7,49.53 R49.2
  Bottom 0.305: v121.92,49.53 127.25,49.53 131.83,44.96 139.7,44.96 140.46,44.2 140.46,39.62 141.22,38.86 155.19,38.86 156.72,40.39 156.72,45.21 156.97,45.47 v163.07,45.47
N$25  (via drill 0.4)
  Top 0.3: R52.2 107.44,55.18 104,51.75 v102.97,51.75
  Top 0.305: Q5.1 146.84,40.66 v146.81,40.64
  Bottom 0.3: 130.56,51.82 103.04,51.82 v102.97,51.75
  Bottom 0.305: 130.56,51.82 136.65,45.72 147.83,45.72 148.34,45.21 148.34,41.15 147.83,40.64 v146.81,40.64
N$26
  Bottom 0.813: TR2.1 148.67,14.81 145.29,11.43 139.19,11.43 137.41,9.65 137.41,5.84 138.43,4.83 142.75,4.83 J7.1
N$27
  Top 0.305: Q6.1 154.94,43.12 154.94,41.4 155.7,40.64 164.34,40.64 164.85,41.15 164.85,47.75 163.26,49.34 C40.1
  Top 0.508: R50.2 C40.1
N$28
  Top 0.3: R42.2 84.9,51.8 87.6,51.8 R44.2 87.7,51.8 88.9,51.8 90.4,51.8 R43.1 | 91.2,32.9 91.2,38.32 89.92,39.57
  Top 0.305: 91.2,32.9 91.2,30.75 91.19,30.73 91.19,30.48 91.57,30.1 U10.5 | 89.92,39.57 88.9,40.59 88.9,51.8
N$33
  Top 0.3: R9.2 102.54,25.14 102.56,23.36 102.56,22.48 101.73,21.4 U9.9
N$34
  Top 0.813: TR1.4 135.87,30.96 136.65,31.75 Q1.4
N$35
  Bottom 0.813: J6.5 130.78,15.07 130.68,15.07 TR1.3
N$36
  Top 0.813: TR2.4 157.71,30.96 160.78,34.04 Q4.4
N$37
  Bottom 0.813: J7.5 157.15,14.87 TR2.3
N$38
  Top 0.813: Q5.4 144.53,33.53 147.09,30.96 TR2.6
N$39
  Top 0.813: TR1.6 120.65,32.16 Q2.4
N$40
  Top 0.3: R34.1 74.5,37.7 77.2,37.7 R35.2 77.3,37.7 80,37.7 R36.1
  Top 0.305: R36.1 80.01,35.05 82.42,32.64 U10.2
N$41
  Top 0.3: 97.79,31.37 98.55,31.37
  Top 0.305: U10.6 97.79,31.37 | R47.1 R46.2 100.84,46.04 | 100.84,46.04 R45.1 | 98.55,31.37 100.84,33.65 100.84,46.04
N$42
  Top 0.3: 79.25,48.8 77.5,48.8 DAC.5 | 81.53,51.05 81.53,55.51 82.86,56.83 R31.1
  Top 0.305: 79.25,48.8 81.5,51.05 81.53,51.05
N$44
  Top 0.3: J3.5 83.39,7.7 85.6,9.91 85.6,19.05 88.39,21.84 95,21.84 95.38,21.46 U9.14
N$46
  Top 0.3: U9.13 96.65,21.46 95.5,22.61 88.14,22.61 84.33,18.8 84.33,10.16 64.52,10.16 63.73,9.37 J3.2
N$49
  Top 0.3: 12.6,46.3 C43.1 | 12.6,49.2 R11.1
  Top 0.305: 12.6,49.2 12.6,46.3
N$50
  Top 0.3: R62.1 57.9,8.21
  Top 0.305: 57.9,8.21 55.24,8.21 J2.5
N$52
  Top 0.3: C35.1 93.3,7.37 93.3,10.6 92.9,11 92.9,12.7 U9.1
N$53
  Top 0.3: 12.9,38.95 R24.1 12.93,39 | R25.1
  Top 0.305: R25.1 12.9,38.95 | U2.2 13.38,39.12 13.26,39 12.93,39
N$54  (via drill 0.4)
  Top 0.3: v28.8,37.8 27,37.8 U2.12 | v23.62,38.61 23.6,38.63 23.6,39.8 23.1,40.3 21.8,40.3 U2.1
  Top 0.305: U2.1 19.56,40.39 16.26,43.69 v10.92,43.69 10.92,41.72 R25.2 | v7.11,57.15 D2.A
  Bottom 0.3: v28.8,37.8 27.99,38.61 v23.62,38.61
  Bottom 0.305: v7.11,57.15 7.11,55.63 9.14,53.59 9.14,44.2 9.65,43.69 v10.92,43.69
N$55
  Top 0.305: J5.2 22.19,7.7 17.87,12.02 6.26,12.02 3.3,14.99 3.3,40.71 R15.1
N$56
  Top 0.305: R14.1 35.85,13.61 35.85,9.83 35.53,9.38 J5.5
N$57
  Top 0.3: 31,13.75 C23.1 | 33.8,13.75 R14.2
  Top 0.305: 33.8,13.75 31,13.75
N$58
  Top 0.3: 40.3,5.3 R19.2 | 40.3,8.1 R18.1
  Top 0.305: 40.3,8.1 40.3,6.86 | 40.3,6.86 40.3,5.3 | 40.3,6.86 43.69,6.86 J2.2
N$60
  Top 0.3: 12.9,31.8 R23.1 | 12.9,35.29 R22.2 | U2.6 20.94,34.04 20.85,34
  Top 0.305: 12.9,35.29 12.9,34 | 12.9,34 12.9,31.8 | 12.9,34 20.85,34
N$61
  Top 0.3: C35.2 95.2,7.37 95.3,7.47 95.3,12.7 U9.3
N$62
  Top 0.3: U2.9 27,34 29.18,34 31.19,36 R27.1 32.8,36.1 32.8,38.9 R26.1 32.7,39 32.7,39.1 27,39.1 U2.13
N$63  (via drill 0.4)
  Top 0.3: v23.88,35.31 U2.5 | C26.2 R20.2 30.16,27.75 26.92,30.99 v23.88,30.99
  Bottom 0.3: v23.88,35.31 v23.88,30.99
N$65
  Top 0.3: 5.1,44.4 R15.2 | 5.1,47.8 C24.1
  Top 0.305: 5.1,47.8 5.1,44.4
N$66
  Top 0.3: C36.2 99.5,7.87 99.5,9.5 98,11 98,12.7 U9.5
N$67
  Top 0.3: C36.1 96.7,8.77 96.7,12.7 U9.4
N$68  (via drill 0.4)
  Top 0.3: R9.1 R58.2 100.54,27.58 v86.28,27.58 | v82.88,37.85 82.88,39.37 79.5,42.75 v79.5,46.71
  Bottom 0.3: v86.28,27.58 82.88,30.97 v82.88,37.85 | v79.5,46.71 78.99,47.22 78.99,58.65 78.21,59.44 69.09,59.44 68.83,59.69 J9.2
N$69
  Top 0.3: 11.5,31.2 11,31.7 R23.2 | 13.11,28.39 12.6,28.9 12.6,28.5 D3.A | U2.7 21.8,32.8 25.1,32.8 25.1,34.6 25.8,35.3 26.9,35.3 U2.10
  Top 0.305: 11.5,31.2 11.5,30 12.6,28.9 | U2.7 19.36,32.77 14.99,28.39 13.11,28.39
N$70
  Top 0.305: C34.1 102.9,7.37 100.1,10.17 100.1,10.2 99.1,11.2 99.1,12.7 U9.6
N$71  (via drill 0.4)
  Top 0.305: C21.1 R7.1 16.32,16.19 16,16.51 9.91,16.51 v7.37,13.97
  Bottom 0.305: J4.5 16.48,6.32 16,5.84 6.86,5.84 6.58,6.12 J4.2 6.58,13.18 v7.37,13.97
N$72
  Top 0.305: R7.2 18.22,17.97 22.16,21.91 R8.1 C20.1
N$73  (via drill 0.4)
  Top 0.3: 20.8,52.1 21.7,52.1 21.7,52 U4.3 | R10.2 20.28,47.73
  Top 0.305: 20.28,47.73 20.28,49.72 19.9,50.1 19.9,51.2 20.8,52.1 | C21.2 11.5,13.65 11.94,13.21 20.83,13.21 21.15,13.53 R61.1 21.08,14.8 v21.08,16.76 | R10.2 20.32,47.69 v20.32,45.97
  Bottom 0.305: v20.32,45.97 20.32,40.89 18.29,38.86 18.29,25.65 21.08,22.86 v21.08,16.76
N$74
  Top 0.3: R11.2 10.7,49.3 10.73,49.33
  Top 0.305: U4.2 17.65,53.21 14.99,50.55 10.73,50.55 | 10.73,50.55 10.73,49.33 | R12.1 10.73,50.55
N$75
  Top 0.3: 12.6,52.1 R12.2 | 12.6,54.8 R13.1 12.7,54.9
  Top 0.305: 12.6,54.8 12.6,52.1 | U4.6 25.02,51.94 24.38,52.58 24.38,53.59 23.5,54.48 U4.1 17.65,54.48 17.24,54.9 12.7,54.9
N$76
  Top 0.3: 5.1,54.8 C22.2 | 10.7,54.8 R13.2
  Top 0.305: 10.7,54.8 5.1,54.8
N$77
  Top 0.305: C33.2 90.1,12.38 92.46,14.73 93.73,14.73 94.1,14.36 U9.2
N$85  (via drill 0.4)
  Top 0.3: v80.02,50.8 77.5,50.8 DAC.8 | v83.4,50.7 84.2,49.9 84.8,49.9 R42.1
  Bottom 0.3: v80.02,50.8 80.12,50.7 v83.4,50.7
N$87
  Top 0.3: U9.8 101.72,10.8 103.38,9.14 106.68,9.14 107.44,8.38 107.44,5.33 107.19,5.08 72.14,5.08 71.36,5.86 71.33,5.87 J3.4
N$88
  Top 0.3: J3.3 69.66,4.32 107.44,4.32 108.46,5.33 108.46,13.72 106.93,15.24 101.09,15.24 100.45,14.59 U9.7
N$89
  Top 0.3: J9.3 69.49,59.33 69.49,43.51 71.9,41.1 71.9,37.4 84.38,24.92 98.4,24.92 100.4,22.92 100.4,19.9 U9.10
PA0  (via drill 0.4)
  Top 0.305: IC1.37 54.84,43.43 56.64,43.43 58.17,41.91 v58.17,39.88 | v118.26,40.55 118.26,42.9 Q2.3
  Top 0.813: Q2.3 118.34,45.44 118.62,45.72 134.11,45.72 | 142.22,45.72 Q5.3 | Q4.3 158.47,45.24 157.99,45.72 142.22,45.72 | Q1.3 134.34,45.49 134.11,45.72 | R54.2 R30.2 142.22,48.87 | 134.11,45.72 142.22,45.72 | 142.22,45.72 142.22,48.87 | TU.2 142.32,48.77 142.22,48.87
  Bottom 0.305: v118.26,40.55 117.47,39.76 58.54,39.76 58.42,39.88 v58.17,39.88
PA1  (via drill 0.4)
  Top 0.3: IC1.36 54.47,42.03 53.85,41.4 53.85,40.89 55.12,39.62 55.63,39.62 | C26.1 28.26,24.13 30.16,22.23 C25.1 29.97,21.4 v29.97,18.03
  Top 0.305: v60.2,29.21 60.2,35.05 55.63,39.62
  Bottom 0.3: v60.2,29.21 57.4,29.21 | 52.07,22.1 51.56,21.59 49.28,21.59 48.26,20.57 J11.5 45.97,18.03 v29.97,18.03
  Bottom 0.305: 57.4,29.21 52.07,23.88 52.07,22.1
PA4  (via drill 0.4)
  Top 0.3: v59.19,27.95 59.24,28 | 55.7,38.3 IC1.33
  Top 0.305: 55.7,38.3 59.24,34.76 59.24,28
  Bottom 0.3: v59.19,27.95 v59.18,27.94
  Bottom 0.305: v59.18,27.94 57.4,27.94 54.61,25.15 54.61,21.59 J11.9
PA5  (via drill 0.4)
  Top 0.3: 58.13,28.19 58.12,28.18 v58.12,26.91
  Top 0.305: IC1.32 58.13,34.79 58.13,28.19
  Bottom 0.305: v58.12,26.91 57.1,25.89 57.1,21.3 56.12,20.32 J11.11
PA6  (via drill 0.4)
  Top 0.3: v39.13,40.48 v37.28,42.33 | 10.8,60.1 10.8,60.6 R29.1 10.7,60.7 10.47,60.7 10.46,60.71 | 54.5,37.3 IC1.31
  Top 0.305: 54.5,37.3 52.08,39.72 v52.08,40.63 | 10.8,60.1 v11.6,59.3 12.37,58.53 D2.C | C31.1 10.46,60.71
  Bottom 0.3: v39.13,40.48 39.41,40.75 51.95,40.75 v52.08,40.63
  Bottom 0.305: v37.28,42.33 20.31,59.3 v11.6,59.3
PA7  (via drill 0.4)
  Top 0.3: 9,28.7 9.2,28.5 D3.C 9.3,28.4 | 7.9,31.7 C30.1 7.9,31.8 | 54,36.7 IC1.30
  Top 0.305: 7.9,31.7 9,30.6 9,28.7 | 9.3,28.4 9.3,26.9 9.05,26.65 R28.1 | 54,36.7 53.1,37.6 v50.68,37.6 | 7.9,31.8 7.9,35.7 9.03,36.83 v19.3,36.83
  Bottom 0.3: v50.68,37.6 50.43,37.35 38.33,37.35 36.05,39.62 20.48,39.62 19.3,38.44 v19.3,36.83
PB0  (via drill 0.4)
  Top 0.3: v51.05,42.93 51.05,42.95 52.3,44.2 IC1.40 | v114.5,44.2 114.5,46.23 115.1,46.83 115.1,50.61 115.9,51.41 116.5,51.41 R48.2 R49.1
  Bottom 0.3: v51.05,42.93 51.57,43.44 113.74,43.44 v114.5,44.2
PB1
  Top 0.3: R52.1 107.4,57.6 R51.2 104.9,59.18 104.52,59.56 99.19,59.56 97.79,58.17 92.96,58.17 87.12,64.01 64.77,64.01 63.25,62.48 63.25,53.09 | 51.74,44.88 IC1.41
  Top 0.305: 63.25,53.09 62.23,52.07 58.93,52.07 51.74,44.88
PB2  (via drill 0.4)
  Top 0.3: 51.2,45.5 IC1.42 | v105.6,49.4 107.03,49.4 109.12,51.5 R38.1 R37.2
  Top 0.305: 51.2,45.5 52.4,46.7 v52.4,47.31
  Bottom 0.3: 80.38,45.86 79.32,44.8
  Bottom 0.305: v52.4,47.31 56.97,47.31 59.48,44.8 79.32,44.8 | v105.6,49.4 102.06,45.86 80.38,45.86
PB3  (via drill 0.4)
  Top 0.3: v51.43,49.67 51.35,49.59 | 59.77,51.48 v58.69,50.4 | 50.7,46 IC1.43 | R40.2 102.3,57.6 99.9,57.6 R41.1 99.62,57.39 92.79,57.39 86.88,63.3 64.9,63.3 63.9,62.3 63.9,52.22 63.16,51.48
  Top 0.305: 50.7,46 51.35,46.65 51.35,49.59 | 63.16,51.48 59.77,51.48
  Bottom 0.305: v51.43,49.67 52.16,50.4 v58.69,50.4
PB5  (via drill 0.4)
  Top 0.3: DAC.3 72.06,49.46 v71.37,48.77 | v61.1,48.9 61.61,49.41 64.16,49.41 v64.67,48.9
  Top 0.305: IC1.1 46.99,47.06 46.99,47.26 v48.08,48.36 47.32,49.12 47.32,57.74 JP1.4
  Bottom 0.3: v71.37,48.77 71.12,48.51 65.06,48.51 v64.67,48.9
  Bottom 0.305: v48.08,48.36 60.56,48.36 v61.1,48.9
PB6
  Top 0.254: 46.23,57.91 45.47,58.67 45.47,62.83
  Top 0.3: IC1.2 46.23,46.69
  Top 0.305: 46.23,57.91 46.23,46.69 | 45.47,62.83 46.64,64 49.7,64 51.21,62.48 JP1.1
PB7  (via drill 0.4)
  Top 0.3: v71.35,50.1 72.9,50.1 DAC.2 | v64.67,51.37 63.63,50.33 | 46.3,45.5 IC1.3
  Top 0.305: 63.63,50.33 v61.85,50.33 | 46.3,45.5 45.15,46.65 v45.15,50.9
  Bottom 0.3: v64.67,51.37 70.08,51.37 v71.35,50.1 | 61.36,50.82 v61.85,50.33 | JP1.3 50.78,61.23 50.8,61.2 50.8,58.59 50.63,58.42 | 61.36,58.42 50.63,58.42 | 50.63,58.42 49.11,58.42
  Bottom 0.305: 61.36,58.42 61.36,50.82 | 49.11,58.42 45.15,54.46 v45.15,50.9
PC0
  Top 0.3: IC1.19 44.96,33.55 44.96,24.64 J11.2
PC1
  Top 0.3: IC1.20 46.3,33.8 45.72,33.22 J11.4
PC2
  Top 0.3: IC1.21 46.35,32.69 46.35,30.35 48.26,28.45 J11.6
PC3
  Top 0.3: J11.8 50.8,29.3 47.5,32.6 IC1.22
PC4
  Top 0.3: 50.1,32.6 IC1.23 | 53.3,22.9 J11.10
  Top 0.305: 50.1,32.6 53.3,29.4 53.3,22.9
PC5
  Top 0.3: 55.8,23.5 55.8,22.9 J11.12 | 50.7,33.2 IC1.24
  Top 0.305: 50.7,33.2 54.3,29.6 54.3,25 55.8,23.5
PC6
  Top 0.3: 58.4,23.1 58.4,22.9 J11.14 | 51.2,33.8 IC1.25
  Top 0.305: 51.2,33.8 54.9,30.1 54.9,26.6 58.4,23.1
PC7
  Top 0.3: 57.9,24.4 60.8,24.4 60.8,23 60.9,22.9 J11.16 | 51.8,34.3 IC1.26
  Top 0.305: 51.8,34.3 55.5,30.6 55.5,26.8 57.9,24.4
PD0  (via drill 0.4)
  Top 0.3: v48.71,35.3 48.71,39.2 45.8,39.2 43,42 IC1.9 | v95.62,23.89 97.9,21.61 97.9,19.9 U9.12
  Bottom 0.3: v95.62,23.89 94.55,24.96
  Bottom 0.305: v48.71,35.3 48.69,35.3 47.65,34.25 47.65,32.09 75.69,32.09 82.83,24.96 94.55,24.96
PD1  (via drill 0.4)
  Top 0.3: v45.5,38.4 42.5,41.4 IC1.10 | v97.68,23.89 99.1,22.47 99.1,19.9 U9.11
  Bottom 0.3: v45.5,38.4 46.01,38.91 52.64,38.91 55.04,36.5 | 72.14,34.2 76.71,34.2 | v97.68,23.89 94.95,26.62
  Bottom 0.305: 72.14,34.2 70.27,36.07 55.48,36.07 55.04,36.5 | 76.71,34.2 78.07,34.2 85.65,26.62 94.95,26.62
PD2  (via drill 0.4)
  Top 0.3: v28.8,40.45 27.05,40.45 U2.14 | v40.57,42.22 40.55,42.19 IC1.11
  Bottom 0.3: v40.57,42.22 39.05,42.22 37.29,40.45 v28.8,40.45
PD3  (via drill 0.4)
  Top 0.3: v36.95,32.95 36.95,33.45 37.24,33.74 37.27,33.79 IC1.12 | v29.05,32.95 28.91,32.8 27,32.8 U2.8
  Bottom 0.3: v36.95,32.95 v29.05,32.95
PD5  (via drill 0.4)
  Top 0.3: v41.9,36.2 42.9,37.2 IC1.14
  Bottom 0.3: 61.2,31.42 62.34,30.29 62.34,21.7 J11.15
  Bottom 0.305: v41.9,36.2 46.68,31.42 61.2,31.42
PD6  (via drill 0.4)
  Top 0.3: v41.91,34.8 41.91,35.01 43.5,36.6 IC1.15
  Bottom 0.305: J11.13 59.69,21.59 59.69,26.67 61.47,28.45 61.47,29.97 61.21,30.23 46.48,30.23 v41.91,34.8
PD7  (via drill 0.4)
  Top 0.3: J11.18 62.48,23.88 | 44.2,36.1 IC1.16
  Top 0.305: 44.2,36.1 45.45,37.35 47.65,37.35 47.65,34.65 v48.7,33.6 | v61.91,33.15 62.48,32.57 62.48,23.88
  Bottom 0.3: 49.41,32.89 v48.7,33.6
  Bottom 0.305: v61.91,33.15 61.66,32.89 49.41,32.89
PFET_A  (via drill 0.4)
  Top 0.3: 80.1,39.5 R36.2 | v125.93,47.37 125.93,50.65 125.89,50.65 126.83,51.5 R39.1
  Top 0.305: U10.1 87.95,33.78 85.34,33.78 | 85.34,33.78 83.06,33.78 81.53,35.31 81.53,38.35 80.39,39.5 80.1,39.5 | v81.74,45 85.34,41.4 85.34,33.78
  Bottom 0.3: v125.93,47.37 125.09,48.2 106.43,48.2
  Bottom 0.305: v81.74,45 103.23,45 106.43,48.2
PFET_B  (via drill 0.4)
  Top 0.3: v150.23,51.3 152.08,51.3 R50.1
  Top 0.305: U10.7 98.68,32.64 99.82,33.78 99.82,40.13 97.79,42.16 96.01,42.16 95.25,42.93 95.25,46.99 96.2,47.94 R47.2 96.77,52.05 v96.71,52.12
  Bottom 0.3: v150.23,51.3 150.23,52.06 149.49,52.8 97.39,52.8 v96.71,52.12
RB4
  Top 0.3: C28.1 49.53,13.72
  Top 0.305: C27.1 49.53,13.72 49.53,19.05 J11.7
RB9  (via drill 0.4)
  Top 0.305: R17.1 39.37,24.38 42.16,21.59 44.7,21.59 45.72,20.57 J11.3 v45.72,16.26 | v7.37,49.78 7.3,49.72 C24.2 C22.1
  Bottom 0.305: v7.37,49.78 7.37,15.75 11.18,11.94 42.16,11.94 45.72,15.49 v45.72,16.26
RB10  (via drill 0.4)
  Top 0.3: 28.96,13.78 C23.2
  Top 0.305: R16.1 37.27,20.32 J11.1 | v28.96,16 28.96,13.78
  Bottom 0.3: 41.4,19.05 41.38,19.07 29.65,19.07 28.96,18.38 v28.96,16
  Bottom 0.305: 41.4,19.05 42.93,19.05 43.18,19.3 J11.1
RESET  (via drill 0.4)
  Top 0.3: 35.21,60.5 C37.2 | 35.21,63.2 R53.1 | 43.4,47.2 45.7,44.9 IC1.4 | 43.4,55.48 43.33,55.54 v43.35,55.57
  Top 0.305: 35.21,63.2 35.21,60.5 | 43.4,55.48 43.4,47.2 | 43.33,55.54 38.42,60.45 C37.2
  Bottom 0.305: v43.35,55.57 43.35,58.85 JP1.5
STATE
  Top 0.3: J11.17 63.5,20.7 64.77,21.97 64.77,23.75 65.6,24.57 65.6,24.64 66.04,25.08 66.04,33.34 65.6,33.78 65.6,60.52 J9.1
V+  (via drill 0.4)
  Top 0.305: v84.48,23.26 71.07,36.68 R3.2
  Top 0.508: F1.1 178.98,35.31
  Top 1.016: BAT.1 179.58,38.35 179.2,37.97 F1.1 | 178.98,35.31 175.26,35.31 168.15,28.19 168.15,18.08 J8.PWR
  Bottom 0.305: v84.48,23.26 85.75,21.99 162.12,21.99 163.87,20.24 J8.PWR

### Text on the board
tPlace: PRIMARY | PRIMARY
tNames: + | +
tValues: 16V | 16V | 16V | 16V | 25V